# Altium project B100AA Development Kit.PrjPcb (part 4 of 5)

## Sheet ADS Sensor Sockets.SchDoc: Pressure Sensor Input Sockets
size A3; ApprovedBy: Mehmet Günce Akkoyun; CheckedBy: Mehmet Günce Akkoyun; Author: Mehmet Günce Akkoyun; CompanyName: Ovoo Electronics; DrawnBy: Mehmet Günce Akkoyun; Engineer: Mehmet Günce Akkoyun; Organization: Ovoo Electronics; Address1: Necip Fazýl Mah. Ortaýrmak Sok.; Address2: Birgül Apt. No: 19/6; Address3: Meram / Konya; Address4: Turkiye; DocumentNumber: AA001; Revision: B100AA Dev Kit
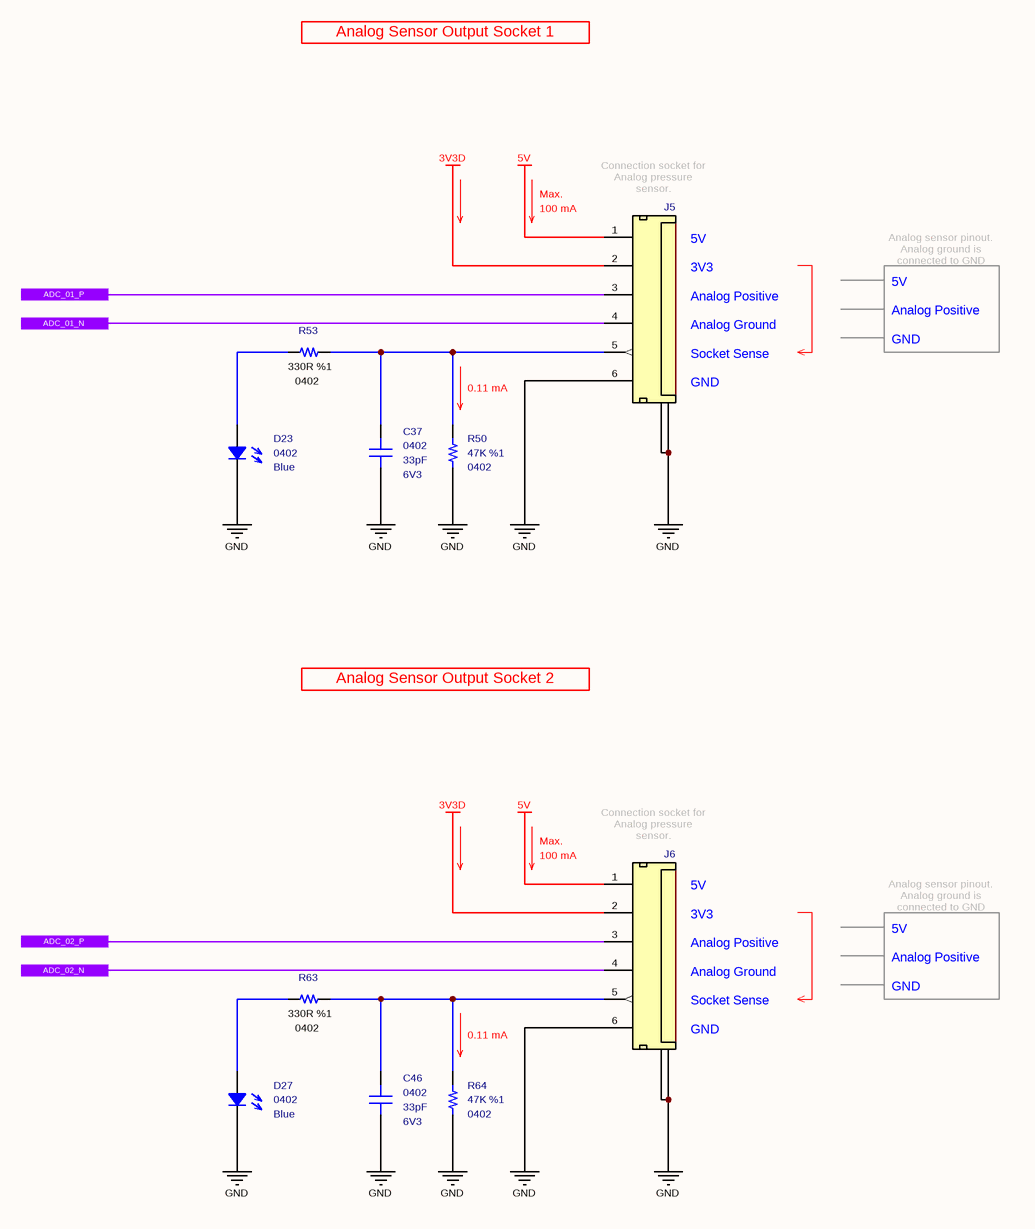
[diagram p25: ADS Sensor Sockets.SchDoc]

### Parts
C37  value 33pF  Case: 0402  Voltage: 6V3  [CAPACITOR_0402]  (hidden comment: Multilayer Ceramic Capacitor)
C46  value 33pF  Case: 0402  Voltage: 6V3  [CAPACITOR_0402]  (hidden comment: Multilayer Ceramic Capacitor)
D23  Case: 0402  Color: Blue  [LED_0402]  (hidden comment: SMD LED (Blue))
D27  Case: 0402  Color: Blue  [LED_0402]  (hidden comment: SMD LED (Blue))
J5  6P Tunic Connector  [Connector_Tunic 6P - H]  (value not drawn)
J6  6P Tunic Connector  [Connector_Tunic 6P - H]  (value not drawn)
R50  value 47K  Tolerance: %1  Case: 0402  [RESISTOR_0402]  (hidden comment: Thick Film Resistor)
R53  value 330R  Tolerance: %1  Case: 0402  [RESISTOR_0402]  (hidden comment: Thick Film Resistor)
R63  value 330R  Tolerance: %1  Case: 0402  [RESISTOR_0402]  (hidden comment: Thick Film Resistor)
R64  value 47K  Tolerance: %1  Case: 0402  [RESISTOR_0402]  (hidden comment: Thick Film Resistor)

### Ports
ADC_01_N, ADC_01_P, ADC_02_N, ADC_02_P

### Nets
3V3D: J5.2(M_DRV) J6.2(M_DRV)
5V: J5.1(VBAT) J6.1(VBAT)
GND: C37.2 C46.2 D23.1 D27.1 J5.6(M_DRV) J5.7(GND) J5.8(GND) J6.6(M_DRV) J6.7(GND) J6.8(GND) R50.1 R64.1
NetC37_1: C37.1 J5.5(M_DRV) R50.2 R53.2
NetC46_1: C46.1 J6.5(M_DRV) R63.2 R64.2
NetD23_2: D23.2 R53.1
NetD27_2: D27.2 R63.1
NetJ5_3: J5.3(M_DRV) ; port ADC_01_P
NetJ5_4: J5.4(M_DRV) ; port ADC_01_N
NetJ6_3: J6.3(M_DRV) ; port ADC_02_P
NetJ6_4: J6.4(M_DRV) ; port ADC_02_N

### Notes on the sheet
- Analog Sensor Output Socket 1
- Max.
- (near J5) Connection socket for Analog pressure sensor.
- 100 mA
- Analog sensor pinout. Analog ground is connected to GND
- 5V
  Analog Positive
  GND
- (near R50) 0.11 mA
- (near J5) 5V
  3V3
  Analog Positive
  Analog Ground
  Socket Sense
  GND
- Analog Sensor Output Socket 2
- (near J6) Connection socket for Analog pressure sensor.
- (near R64) 0.11 mA
- (near J6) 5V
  3V3
  Analog Positive
  Analog Ground
  Socket Sense
  GND
- Title
- Size:
- Date:
- A3
- Number:
- Time:
- Revision:
- Sheet
- of
- File:

### Library data of the parts
C37 C46 = Capacitor - 33pF [0402-6V3]: Capacitor - 33pF [0402] (Ceramic); Manufacturer_Name: Kemet; Manufacturer_Part_Number: C0402C330J9RACAUTO; Dielectric: X7R; Tolerance: 10%; Height: 0.5mm; Mouser_Part_Number: 80-C0402C330J9RAUTO; Maximum Operating Temperature: +125; Minimum Operating Temperature: -55; ROHS: Yes; ComponentLink1Description: DataSheet; ComponentLink1URL: https://api.kemet.com/component-edge/download/datasheet/C0402C330J9RACAUTO.pdf; ComponentLink2Description: Mouser; ComponentLink2URL: https://www.mouser.com/Search/Refine.aspx?Keyword=80-C0402C330J9RAUTO; Supplier 1: Mouser; Supplier Part Number 1: 80-C0402C330J9RAUTO
D23 D27 = Diode - LED (0402-Blue): as D53-D55 on sheet GSM Control Signals; Mouser_Part_Number: 755-SMLP13BC8TT86; ROHS: Yes; ComponentLink1Description: DataSheet; ComponentLink1URL: https://d1d2qsbl8m0m72.cloudfront.net/en/products/databook/datasheet/opto/led/chip_mono/sml-p1-e.pdf; ComponentLink2Description: Mouser; ComponentLink2URL: https://www.mouser.com.tr/ProductDetail/ROHM-Semiconductor/SMLP13BC8TT86?qs=%2Fha2pyFaduidYDgXFKL%252BNZwCVZNUI4FlyPWWbVDx1b6ABmzS%252BS2f0w%3D%3D; Supplier 1: Mouser; Supplier 2: Digi-Key; Supplier Part Number 1: 755-SMLP13BC8TT86; Supplier Part Number 2: 846-1112-1-ND
J5 J6 = Connector - Mini Tunic 6P (1.25): Mini Tunic Connector with 6P; Manufacturer_Name: Molex; Manufacturer_Part_Number: 53261-0671; ROHS: Yes; Supplier 1: Avnet; Supplier 2: Mouser; Supplier 3: Arrow; Supplier 4: Farnell; Supplier 5: Newark; Supplier 6: Digi-Key; Supplier Part Number 1: 0532610671; Supplier Part Number 2: 538-53261-0671; Supplier Part Number 3: 53261-0671; Supplier Part Number 4: 1125375; Supplier Part Number 5: 93K4246; Supplier Part Number 6: WM7624CT-ND; System: Connector
R50 R64 = Resistor - 47K: Thick Film Resistors - SMD 1/16 W 47 Kohms 1%; Manufacturer_Name: Vishay; Manufacturer_Part_Number: CRCW040247K0FKED; Height: 0.4mm; Mouser_Part_Number: 71-CRCW0402-47K-E3; ComponentLink1Description: DataSheet; ComponentLink1URL: https://www.mouser.com.tr/datasheet/2/427/dcrcwe3-1762152.pdf; ComponentLink2Description: Mouser; ComponentLink2URL: https://www.mouser.com.tr/ProductDetail/Vishay-Dale/CRCW040247K0FKED?qs=sGAEpiMZZMu61qfTUdNhG2DpbjADlD3GL%252B3h1elTxqU%3D; Supplier 1: Mouser; Supplier 2: Digi-Key; Supplier Part Number 1: 71-CRCW040247K0FKEDH; Supplier Part Number 2: 541-47.0KYCT-ND
R53 R63 = Resistor - 330R: as R120-R122 on sheet GSM Control Signals; Height: 0.4mm; ComponentLink1Description: DataSheet; ComponentLink1URL: https://www.mouser.com.tr/datasheet/2/427/dcrcwe3-1762152.pdf; ComponentLink2Description: Mouser; ComponentLink2URL: https://www.mouser.com.tr/ProductDetail/Vishay-Dale/CRCW0402330RFKED?qs=sGAEpiMZZMu61qfTUdNhG2DpbjADlD3GGS6SwBlLi5Q%3D; Supplier 1: Mouser; Supplier 2: Digi-Key; Supplier Part Number 2: 541-330LCT-ND; Supplier Part Number 1: 71-CRCW0402-330-E3; Mouser Part Number: 71-CRCW0402-330-E3

## Sheet Digital ICSP Test Points.SchDoc: Digital ICSP Outputs
size A4; ApprovedBy: Mehmet Günce Akkoyun; CheckedBy: Mehmet Günce Akkoyun; Author: Mehmet Günce Akkoyun; CompanyName: Ovoo Electronics; DrawnBy: Mehmet Günce Akkoyun; Engineer: Mehmet Günce Akkoyun; Organization: Ovoo Electronics; Address1: Necip Fazýl Mah. Ortaýrmak Sok.; Address2: Birgül Apt. No: 19/6; Address3: Meram / Konya; Address4: Turkiye; DocumentNumber: AA001; Revision: B100AA Dev Kit
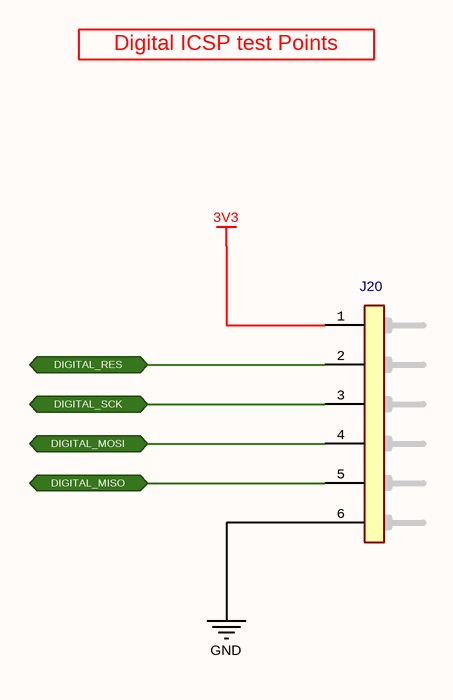
[diagram p26: Digital ICSP Test Points.SchDoc]

### Parts
J20  2.54 mm Pitch 6P Male Connector  [6P Header]  (value not drawn)

### Ports
DIGITAL_MISO (bidir), DIGITAL_MOSI (bidir), DIGITAL_RES (bidir), DIGITAL_SCK (bidir)

### Nets
3V3: J20.1(Pin-1)
GND: J20.6(Pin-6)
NetJ12_43: J20.2(Pin-2) ; port DIGITAL_RES
NetJ12_44: J20.3(Pin-3) ; port DIGITAL_SCK
NetJ12_45: J20.4(Pin-4) ; port DIGITAL_MOSI
NetJ12_46: J20.5(Pin-5) ; port DIGITAL_MISO

### Notes on the sheet
- Digital ICSP test Points
- Title
- Size:
- Date:
- A4
- Number:
- Time:
- Revision:
- Sheet
- of
- File:

### Library data of the parts
J20 = Connector - Male Header 6P (2.54): Headers & Wire Housings BREAKAWAY HDR VERT 6; Manufacturer Name: Molex; Position: 6; Row: 1; Pitch: 2.54 mm; Manufacturer Part Number: 22-28-4063; Mouser Part Number: 538-22-28-4063; ROHS: Yes; ComponentLink1Description: DataSheet; ComponentLink1URL: https://www.mouser.com.tr/datasheet/2/276/0022284063_PCB_HEADERS-228265.pdf; ComponentLink2Description: Mouser; ComponentLink2URL: https://www.mouser.com.tr/ProductDetail/Molex/22-28-4063?qs=sGAEpiMZZMs%252BGHln7q6pm%252BS0pk2Wo0XxVjxVgqsrZJ8%3D; Supplier 1: Mouser; Supplier 2: Digi-Key; Supplier Part Number 2: WM50016-06-ND; Supplier Part Number 1: 538-22-28-4063

## Sheet Master MCU ICSP Communication.SchDoc: Master MCU ICSP Communication Socket
size A4; ApprovedBy: Mehmet Günce Akkoyun; CheckedBy: Mehmet Günce Akkoyun; Author: Mehmet Günce Akkoyun; CompanyName: Ovoo Electronics; DrawnBy: Mehmet Günce Akkoyun; Engineer: Mehmet Günce Akkoyun; Organization: Ovoo Electronics; Address1: Necip Fazýl Mah. Ortaýrmak Sok.; Address2: Birgül Apt. No: 19/6; Address3: Meram / Konya; Address4: Turkiye; DocumentNumber: AA001; Revision: B100AA Dev Kit
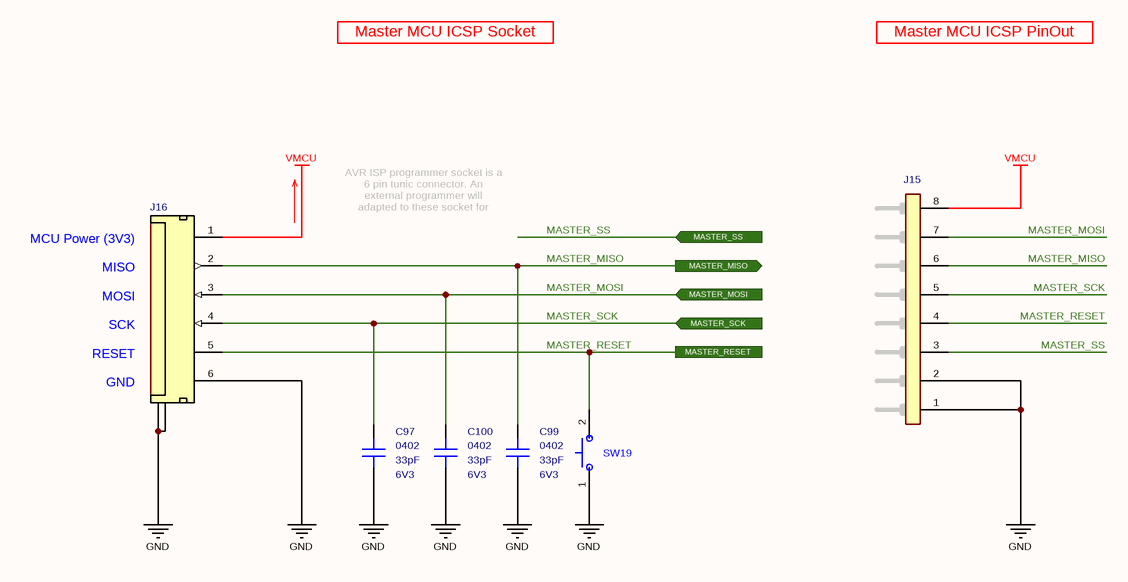
[diagram p27: Master MCU ICSP Communication.SchDoc]

### Parts
C97  value 33pF  Case: 0402  Voltage: 6V3  [CAPACITOR_0402]  (hidden comment: Multilayer Ceramic Capacitor)
C99  value 33pF  Case: 0402  Voltage: 6V3  [CAPACITOR_0402]  (hidden comment: Multilayer Ceramic Capacitor)
C100  value 33pF  Case: 0402  Voltage: 6V3  [CAPACITOR_0402]  (hidden comment: Multilayer Ceramic Capacitor)
J15  2.54 mm Pitch 8P Male Connector  [8P Header]  (value not drawn)
J16  6P Tunic Connector  [Connector_Tunic 6P - H]  (value not drawn)
SW19  Tactile Switches  [PTS526_Switch]  (value not drawn)

### Ports
MASTER_MISO (out), MASTER_MOSI (in), MASTER_RESET, MASTER_SCK (in), MASTER_SS (in)

### Nets
GND: C97.2 C99.2 C100.2 J15.1(Pin-1) J15.2(Pin-2) J16.6(M_DRV) J16.7(GND) J16.8(GND) SW19.1(NC)
VMCU: J15.8(Pin-8) J16.1(VBAT)
MASTER_MISO: C99.1 J15.6(Pin-6) J16.2(M_DRV) ; port MASTER_MISO
MASTER_MOSI: C100.1 J15.7(Pin-7) J16.3(M_DRV) ; port MASTER_MOSI
MASTER_RESET: J15.4(Pin-4) J16.5(M_DRV) SW19.2(COM) ; port MASTER_RESET
MASTER_SCK: C97.1 J15.5(Pin-5) J16.4(M_DRV) ; port MASTER_SCK
MASTER_SS: J15.3(Pin-3) ; port MASTER_SS

### Notes on the sheet
- Master MCU ICSP Socket
- Master MCU ICSP PinOut
- AVR ISP programmer socket is a 6 pin tunic connector. An external programmer will adapted to these socket for programming MCU.
- (near J16) MCU Power (3V3)
  MISO
  MOSI
  SCK
  RESET
  GND
- Title
- Size:
- Date:
- A4
- Number:
- Time:
- Revision:
- Sheet
- of
- File:

### Library data of the parts
C97 C99 C100 = Capacitor - 33pF [0402-6V3]: as C37 on sheet ADS Sensor Sockets; Height: 0.5mm; Mouser_Part_Number: 80-C0402C330J9RAUTO; Maximum Operating Temperature: +125; Minimum Operating Temperature: -55; ROHS: Yes; ComponentLink1Description: DataSheet; ComponentLink1URL: https://api.kemet.com/component-edge/download/datasheet/C0402C330J9RACAUTO.pdf; ComponentLink2Description: Mouser; ComponentLink2URL: https://www.mouser.com/Search/Refine.aspx?Keyword=80-C0402C330J9RAUTO; Supplier 1: Mouser; Supplier Part Number 1: 80-C0402C330J9RAUTO
J15 = Connector - Male Header 8P (2.54): Headers & Wire Housings BREAKAWAY HDR VERT 8; Manufacturer Name: Molex; Position: 8; Row: 1; Pitch: 2.54 mm; Manufacturer Part Number: 22-28-4083; Mouser Part Number: 538-22-28-4083; ROHS: Yes; ComponentLink1Description: DataSheet; ComponentLink1URL: https://www.mouser.com.tr/datasheet/2/276/0022284063_PCB_HEADERS-228265.pdf; ComponentLink2Description: Mouser; ComponentLink2URL: https://www.mouser.com.tr/ProductDetail/Molex/22-28-4083/?qs=%2Fha2pyFaduguMWEp6M%252Bj0x6fHxUvnRGD%252BIxBoa6MO5w%3D
J16 = Connector - Mini Tunic 6P (1.25): as J5 on sheet ADS Sensor Sockets; ROHS: Yes; Supplier 1: Avnet; Supplier 2: Mouser; Supplier 3: Arrow; Supplier 4: Farnell; Supplier 5: Newark; Supplier 6: Digi-Key; Supplier Part Number 1: 0532610671; Supplier Part Number 2: 538-53261-0671; Supplier Part Number 3: 53261-0671; Supplier Part Number 4: 1125375; Supplier Part Number 5: 93K4246; Supplier Part Number 6: WM7624CT-ND; System: Connector
SW19 = Switch - Tactile: Tactile Switches 50mA 12VDC, 5.2x5.2mm, 0.8mm H, 260gf, G leads.; Manufacturer Name: C&K Switches; Manufacturer Part Number: PTS526 SK08 SMTR2 LFS; Height: 0.8mm; Mouser Part Number: 611-PTS526SK08SMTR2L; ComponentLink1Description: DataSheet; ComponentLink1URL: https://eu.mouser.com/datasheet/2/60/pts526-1651200.pdf; ComponentLink2Description: Mouser; ComponentLink2URL: https://eu.mouser.com/ProductDetail/CK/PTS526-SK08-SMTR2-LFS?qs=sGAEpiMZZMsgGjVA3toVBL%2FRce%252ByN3s1hQPqiLlQ%252BeM%3D; Supplier 1: Future Electronics; Supplier 2: Mouser; Supplier 3: Arrow; Supplier 4: Digi-Key; Supplier Part Number 1: PTS526SK08SMTR2LFS-REEL; Supplier Part Number 2: 611-PTS526SK08SMTR2L; Supplier Part Number 3: PTS526 SK08 SMTR2 LFS; Supplier Part Number 4: CKN12219-1-ND

## Sheet UART Communication.SchDoc: UART Communication
size A2; ApprovedBy: Mehmet Günce Akkoyun; CheckedBy: Mehmet Günce Akkoyun; Author: Mehmet Günce Akkoyun; CompanyName: Ovoo Electronics; DrawnBy: Mehmet Günce Akkoyun; Engineer: Mehmet Günce Akkoyun; Organization: Ovoo Electronics; Address1: Necip Fazýl Mah. Ortaýrmak Sok.; Address2: Birgül Apt. No: 19/6; Address3: Meram / Konya; Address4: Turkiye; DocumentNumber: AA001; Revision: B100AA Dev Kit
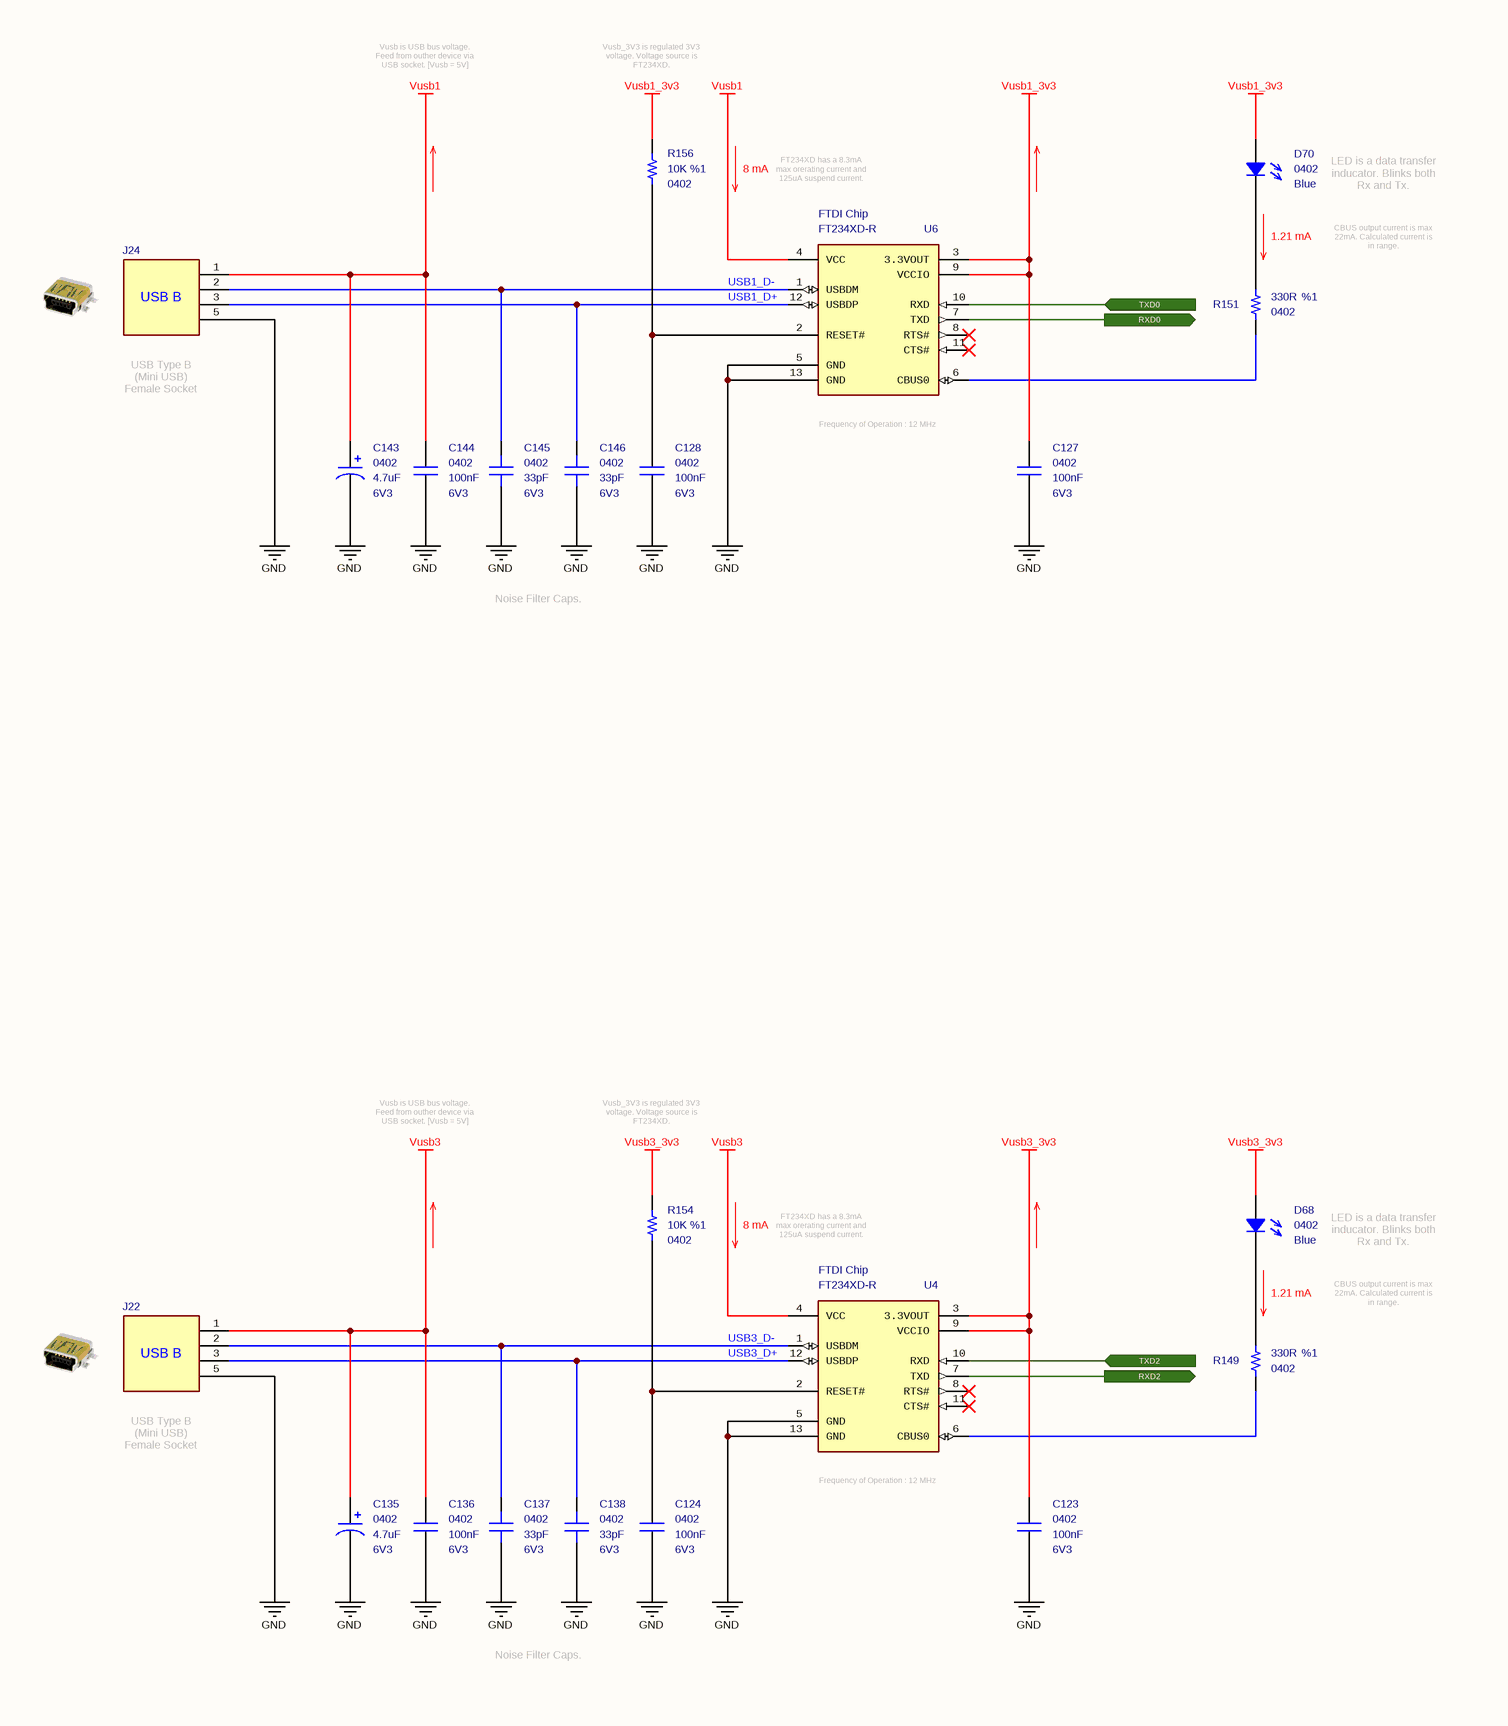
[diagram p28: UART Communication.SchDoc, left]
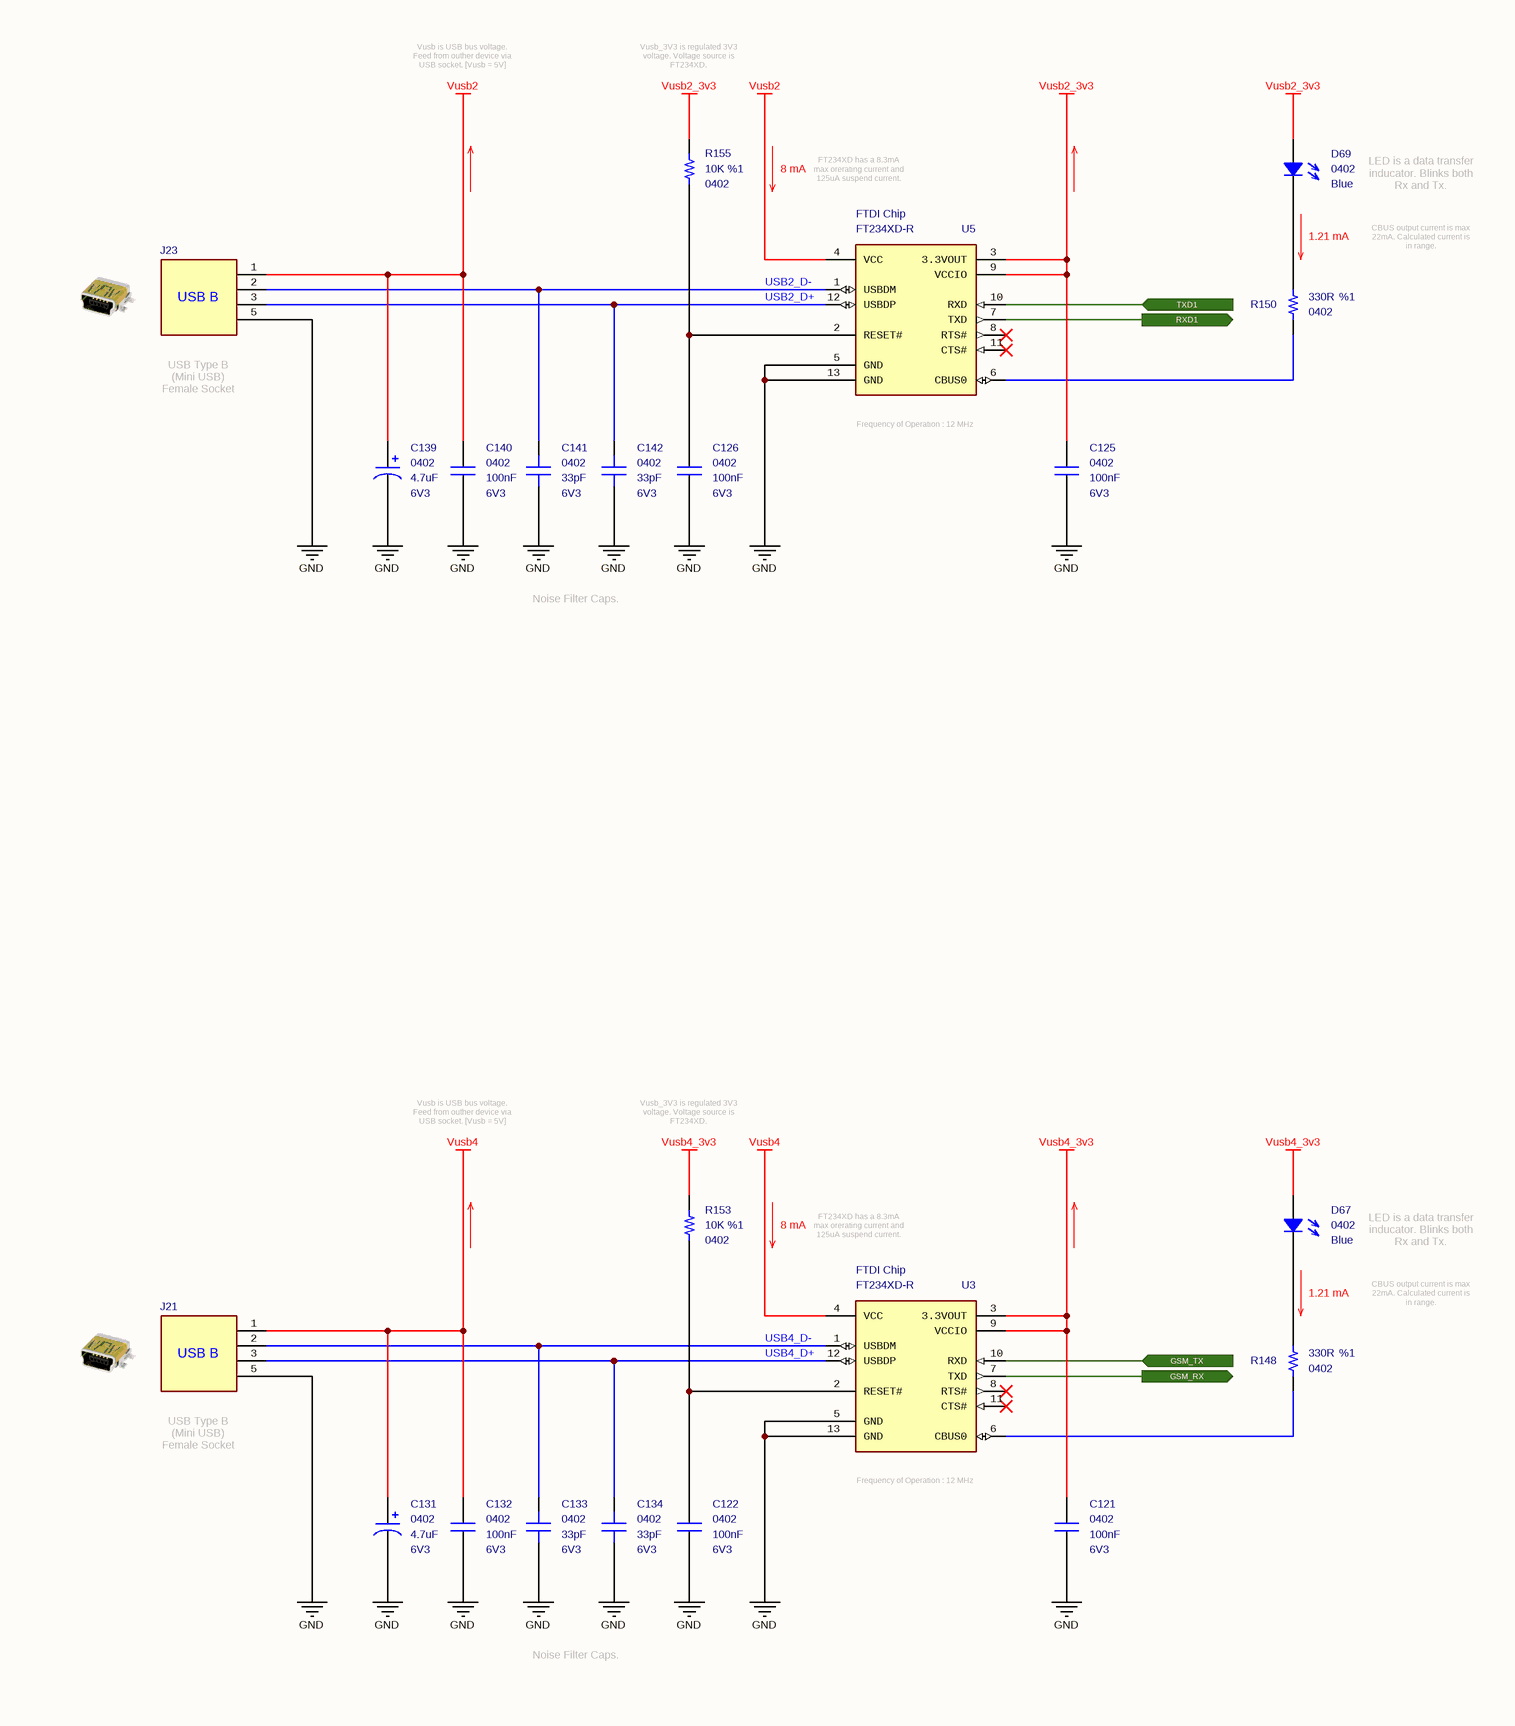
[diagram p29: UART Communication.SchDoc, right]

### Parts
C121  value 100nF  Case: 0402  Voltage: 6V3  [CAPACITOR_0402]  (hidden comment: Multilayer Ceramic Capacitor)
C122  value 100nF  Case: 0402  Voltage: 6V3  [CAPACITOR_0402]  (hidden comment: Multilayer Ceramic Capacitor)
C123  value 100nF  Case: 0402  Voltage: 6V3  [CAPACITOR_0402]  (hidden comment: Multilayer Ceramic Capacitor)
C124  value 100nF  Case: 0402  Voltage: 6V3  [CAPACITOR_0402]  (hidden comment: Multilayer Ceramic Capacitor)
C125  value 100nF  Case: 0402  Voltage: 6V3  [CAPACITOR_0402]  (hidden comment: Multilayer Ceramic Capacitor)
C126  value 100nF  Case: 0402  Voltage: 6V3  [CAPACITOR_0402]  (hidden comment: Multilayer Ceramic Capacitor)
C127  value 100nF  Case: 0402  Voltage: 6V3  [CAPACITOR_0402]  (hidden comment: Multilayer Ceramic Capacitor)
C128  value 100nF  Case: 0402  Voltage: 6V3  [CAPACITOR_0402]  (hidden comment: Multilayer Ceramic Capacitor)
C131  value 4.7uF  Case: 0402  Voltage: 6V3  [CAPACITOR_0402]  (hidden comment: Multilayer Ceramic Capacitors)
C132  value 100nF  Case: 0402  Voltage: 6V3  [CAPACITOR_0402]  (hidden comment: Multilayer Ceramic Capacitor)
C133  value 33pF  Case: 0402  Voltage: 6V3  [CAPACITOR_0402]  (hidden comment: Multilayer Ceramic Capacitor)
C134  value 33pF  Case: 0402  Voltage: 6V3  [CAPACITOR_0402]  (hidden comment: Multilayer Ceramic Capacitor)
C135  value 4.7uF  Case: 0402  Voltage: 6V3  [CAPACITOR_0402]  (hidden comment: Multilayer Ceramic Capacitors)
C136  value 100nF  Case: 0402  Voltage: 6V3  [CAPACITOR_0402]  (hidden comment: Multilayer Ceramic Capacitor)
C137  value 33pF  Case: 0402  Voltage: 6V3  [CAPACITOR_0402]  (hidden comment: Multilayer Ceramic Capacitor)
C138  value 33pF  Case: 0402  Voltage: 6V3  [CAPACITOR_0402]  (hidden comment: Multilayer Ceramic Capacitor)
C139  value 4.7uF  Case: 0402  Voltage: 6V3  [CAPACITOR_0402]  (hidden comment: Multilayer Ceramic Capacitors)
C140  value 100nF  Case: 0402  Voltage: 6V3  [CAPACITOR_0402]  (hidden comment: Multilayer Ceramic Capacitor)
C141  value 33pF  Case: 0402  Voltage: 6V3  [CAPACITOR_0402]  (hidden comment: Multilayer Ceramic Capacitor)
C142  value 33pF  Case: 0402  Voltage: 6V3  [CAPACITOR_0402]  (hidden comment: Multilayer Ceramic Capacitor)
C143  value 4.7uF  Case: 0402  Voltage: 6V3  [CAPACITOR_0402]  (hidden comment: Multilayer Ceramic Capacitors)
C144  value 100nF  Case: 0402  Voltage: 6V3  [CAPACITOR_0402]  (hidden comment: Multilayer Ceramic Capacitor)
C145  value 33pF  Case: 0402  Voltage: 6V3  [CAPACITOR_0402]  (hidden comment: Multilayer Ceramic Capacitor)
C146  value 33pF  Case: 0402  Voltage: 6V3  [CAPACITOR_0402]  (hidden comment: Multilayer Ceramic Capacitor)
D67  Case: 0402  Color: Blue  [LED_0402]  (hidden comment: SMD LED (Blue))
D68  Case: 0402  Color: Blue  [LED_0402]  (hidden comment: SMD LED (Blue))
D69  Case: 0402  Color: Blue  [LED_0402]  (hidden comment: SMD LED (Blue))
D70  Case: 0402  Color: Blue  [LED_0402]  (hidden comment: SMD LED (Blue))
J21  Mini USB Type B Connector  [USB Micro B Female - Vertical]  (value not drawn)
J22  Mini USB Type B Connector  [USB Micro B Female - Vertical]  (value not drawn)
J23  Mini USB Type B Connector  [USB Micro B Female - Vertical]  (value not drawn)
J24  Mini USB Type B Connector  [USB Micro B Female - Vertical]  (value not drawn)
R148  value 330R  Tolerance: %1  Case: 0402  [RESISTOR_0402]  (hidden comment: Thick Film Resistor)
R149  value 330R  Tolerance: %1  Case: 0402  [RESISTOR_0402]  (hidden comment: Thick Film Resistor)
R150  value 330R  Tolerance: %1  Case: 0402  [RESISTOR_0402]  (hidden comment: Thick Film Resistor)
R151  value 330R  Tolerance: %1  Case: 0402  [RESISTOR_0402]  (hidden comment: Thick Film Resistor)
R153  value 10K  Tolerance: %1  Case: 0402  [RESISTOR_0402]  (hidden comment: Thick Film Resistor)
R154  value 10K  Tolerance: %1  Case: 0402  [RESISTOR_0402]  (hidden comment: Thick Film Resistor)
R155  value 10K  Tolerance: %1  Case: 0402  [RESISTOR_0402]  (hidden comment: Thick Film Resistor)
R156  value 10K  Tolerance: %1  Case: 0402  [RESISTOR_0402]  (hidden comment: Thick Film Resistor)
U3  Manufacturer_Part_Number: FT234XD-R  Manufacturer_Name: FTDI Chip  [DFN-12]  (hidden comment: USB/UART IC)
U4  Manufacturer_Part_Number: FT234XD-R  Manufacturer_Name: FTDI Chip  [DFN-12]  (hidden comment: USB/UART IC)
U5  Manufacturer_Part_Number: FT234XD-R  Manufacturer_Name: FTDI Chip  [DFN-12]  (hidden comment: USB/UART IC)
U6  Manufacturer_Part_Number: FT234XD-R  Manufacturer_Name: FTDI Chip  [DFN-12]  (hidden comment: USB/UART IC)

### Ports
GSM_RX (out), GSM_TX (in), RXD0 (out), RXD1 (out), RXD2 (out), TXD0 (in), TXD1 (in), TXD2 (in)

### Nets
GND: C121.2 C122.2 C123.2 C124.2 C125.2 C126.2 C127.2 C128.2 C131.2 C132.1 C133.2 C134.2 C135.2 C136.1 C137.2 C138.2 C139.2 C140.1 C141.2 C142.2 C143.2 C144.1 C145.2 C146.2 J21.5(GND) J22.5(GND) J23.5(GND) J24.5(GND) U3.5(GND) U3.13(GND) U4.5(GND) U4.13(GND) U5.5(GND) U5.13(GND) U6.5(GND) U6.13(GND)
Vusb1: C143.1 C144.2 J24.1(Vbus) U6.4(VCC)
Vusb1_3v3: C127.1 D70.2 R156.2 U6.3(3.3VOUT) U6.9(VCCIO)
Vusb2: C139.1 C140.2 J23.1(Vbus) U5.4(VCC)
Vusb2_3v3: C125.1 D69.2 R155.2 U5.3(3.3VOUT) U5.9(VCCIO)
Vusb3: C135.1 C136.2 J22.1(Vbus) U4.4(VCC)
Vusb3_3v3: C123.1 D68.2 R154.2 U4.3(3.3VOUT) U4.9(VCCIO)
Vusb4: C131.1 C132.2 J21.1(Vbus) U3.4(VCC)
Vusb4_3v3: C121.1 D67.2 R153.2 U3.3(3.3VOUT) U3.9(VCCIO)
USB1_D+: C146.1 J24.3(D+) U6.12(USBDP)
USB1_D-: C145.1 J24.2(D-) U6.1(USBDM)
USB2_D+: C142.1 J23.3(D+) U5.12(USBDP)
USB2_D-: C141.1 J23.2(D-) U5.1(USBDM)
USB3_D+: C138.1 J22.3(D+) U4.12(USBDP)
USB3_D-: C137.1 J22.2(D-) U4.1(USBDM)
USB4_D+: C134.1 J21.3(D+) U3.12(USBDP)
USB4_D-: C133.1 J21.2(D-) U3.1(USBDM)
NetC122_1: C122.1 R153.1 U3.2(RESET#)
NetC124_1: C124.1 R154.1 U4.2(RESET#)
NetC126_1: C126.1 R155.1 U5.2(RESET#)
NetC128_1: C128.1 R156.1 U6.2(RESET#)
NetD67_1: D67.1 R148.1
NetD68_1: D68.1 R149.1
NetD69_1: D69.1 R150.1
NetD70_1: D70.1 R151.1
NetJ7_35: U6.10(RXD) ; port TXD0
NetJ7_36: U6.7(TXD) ; port RXD0
NetJ7_37: U5.10(RXD) ; port TXD1
NetJ7_38: U5.7(TXD) ; port RXD1
NetJ7_39: U4.10(RXD) ; port TXD2
NetJ7_40: U4.7(TXD) ; port RXD2
NetJ12_56: U3.10(RXD) ; port GSM_TX
NetJ12_57: U3.7(TXD) ; port GSM_RX
NetR148_2: R148.2 U3.6(CBUS0)
NetR149_2: R149.2 U4.6(CBUS0)
NetR150_2: R150.2 U5.6(CBUS0)
NetR151_2: R151.2 U6.6(CBUS0)

Not connected (* = marked no-connect by the designer): U3 8(RTS#)* 11(CTS#)*; U4 8(RTS#)* 11(CTS#)*; U5 8(RTS#)* 11(CTS#)*; U6 8(RTS#)* 11(CTS#)*

### Notes on the sheet
- Vusb is USB bus voltage. Feed from outher device via USB socket. [Vusb = 5V]
- Vusb_3V3 is regulated 3V3 voltage. Voltage source is FT234XD.
- 8 mA
- FT234XD has a 8.3mA max orerating current and 125uA suspend current.
- LED is a data transfer inducator. Blinks both Rx and Tx.
- 1.21 mA
- CBUS output current is max 22mA. Calculated current is in range.
- (near J24) USB Type B
  (Mini USB)
  Female Socket
- (near U6) Frequency of Operation : 12 MHz
- (near J23) USB Type B
  (Mini USB)
  Female Socket
- (near U5) Frequency of Operation : 12 MHz
- Noise Filter Caps.
- (near J22) USB Type B
  (Mini USB)
  Female Socket
- (near U4) Frequency of Operation : 12 MHz
- (near J21) USB Type B
  (Mini USB)
  Female Socket
- (near U3) Frequency of Operation : 12 MHz
- Title
- Size:
- Date:
- File:
- A2
- Number:
- Time:
- Revision:
- Sheet
- of
- (in symbol Connector - Mini USB Female (Vertical)) USB B

### Library data of the parts
C121-C128 C132 C136 C140 C144 = Capacitor - 100nF [0402-6V3]: Capacitor - 100nF [0402-6V3] (Ceramic); Manufacturer_Name: AVX; Manufacturer_Part_Number: 04026D104KAT4A; Dielectric: X5R; Tolerance: %10; Height: 0.25mm; Mouser_Part_Number: 581-04026D104KAT4A; ComponentLink1Description: Mouser; ComponentLink1URL: https://www.mouser.com.tr/ProductDetail/AVX/04026D104KAT4A?qs=sGAEpiMZZMs0AnBnWHyRQPg4iYkCw7IMED%2F4kpqgf7w%3D; ComponentLink2Description: DataSheet; ComponentLink2URL: https://www.mouser.com.tr/datasheet/2/40/cx5r-776519.pdf; ROHS: Yes; Maximum Operating Temperature: +85; Minimum Operating Temperature: -55; Supplier 1: Avnet; Supplier Part Number 1: 04026D104KAT4A
C131 C135 C139 C143 = Capacitor - 4.7uF [0402-6V3): Capacitor - 4.7uF [0402] (Ceramic); Manufacturer_Name: Kemet; Manufacturer_Part_Number: C0402C475M9PACTU; Dielectric: X5R; Tolerance: %20; Height: 0.5mm; Mouser_Part_Number: 80-C0402C475M9P; ComponentLink1Description: Mouser; ComponentLink1URL: https://www.mouser.com.tr/ProductDetail/KEMET/C0402C475M9PACTU?qs=x4XeXhDQKnr0GX0Xu9DUoQ==; ComponentLink2Description: DataSheet; ComponentLink2URL: https://www.mouser.com.tr/datasheet/2/40/cx5r-776519.pdf; ROHS: Yes; Maximum Operating Temperature: +85; Minimum Operating Temperature: -55; Supplier 1: Mouser; Supplier 2: Arrow; Supplier 3: Farnell; Supplier 4: Digi-Key; Supplier Part Number 1: 80-C0402C475M9P; Supplier Part Number 2: C0402C475M9PACTU; Supplier Part Number 3: 2750760; Supplier Part Number 4: 399-13068-1-ND
C133 C134 C137 C138 C141 C142 C145 C146 = Capacitor - 33pF [0402-6V3]: as C37 on sheet ADS Sensor Sockets; Height: 0.5mm; Mouser_Part_Number: 80-C0402C330J9RAUTO; Maximum Operating Temperature: +125; Minimum Operating Temperature: -55; ROHS: Yes; ComponentLink1Description: DataSheet; ComponentLink1URL: https://api.kemet.com/component-edge/download/datasheet/C0402C330J9RACAUTO.pdf; ComponentLink2Description: Mouser; ComponentLink2URL: https://www.mouser.com/Search/Refine.aspx?Keyword=80-C0402C330J9RAUTO; Supplier 1: Mouser; Supplier Part Number 1: 80-C0402C330J9RAUTO
D67-D70 = Diode - LED (0402-Blue): as D53-D55 on sheet GSM Control Signals; Mouser_Part_Number: 755-SMLP13BC8TT86; ROHS: Yes; ComponentLink1Description: DataSheet; ComponentLink1URL: https://d1d2qsbl8m0m72.cloudfront.net/en/products/databook/datasheet/opto/led/chip_mono/sml-p1-e.pdf; ComponentLink2Description: Mouser; ComponentLink2URL: https://www.mouser.com.tr/ProductDetail/ROHM-Semiconductor/SMLP13BC8TT86?qs=%2Fha2pyFaduidYDgXFKL%252BNZwCVZNUI4FlyPWWbVDx1b6ABmzS%252BS2f0w%3D%3D; Supplier 1: Mouser; Supplier 2: Digi-Key; Supplier Part Number 1: 755-SMLP13BC8TT86; Supplier Part Number 2: 846-1112-1-ND
J21-J24 = Connector - Mini USB Female (Vertical): USB Connectors MINI B RECEPT RA SMT W/ POST; Manufacturer_Part_Number: 105133-0011; Manufacturer_Name: Molex; Pitch: 0.8mm; Contact: 5; ROHS: Yes; ComponentLink1Description: DataSheet; ComponentLink1URL: https://eu.mouser.com/datasheet/2/276/1051330011_IO_CONNECTORS-704707.pdf; ComponentLink2Description: Mouser; ComponentLink2URL: https://eu.mouser.com/ProductDetail/Molex/105133-0011?qs=sGAEpiMZZMulM8LPOQ%252Byk9ef5KmzwulGtEmCDWJwe7A%3D; Case: SMD; Mouser_Part_Number: 538-105133-0011; Supplier 1: Mouser; Supplier 2: Arrow; Supplier 3: Farnell; Supplier 4: Digi-Key; Supplier Part Number 1: 538-105133-0011; Supplier Part Number 2: 105133-0011; Supplier Part Number 3: 2614949; Supplier Part Number 4: WM10134CT-ND; System: Connector
R148-R151 = Resistor - 330R: Thick Film Resistors - SMD 1/16 W 330 Ohm 1%; Manufacturer_Name: Vishay; Manufacturer_Part_Number: CRCW0402330RFKED; Height: 0.4mm; Mouser_Part_Number: 71-CRCW0402-330-E3; ComponentLink1Description: DataSheet; ComponentLink1URL: https://www.mouser.com.tr/datasheet/2/427/dcrcwe3-1762152.pdf; ComponentLink2Description: Mouser; ComponentLink2URL: https://www.mouser.com.tr/ProductDetail/Vishay-Dale/CRCW0402330RFKED?qs=sGAEpiMZZMu61qfTUdNhG2DpbjADlD3GGS6SwBlLi5Q%3D; Supplier 1: Mouser; Supplier 2: Digi-Key; Supplier Part Number 2: 541-330LCT-ND; Supplier Part Number 1: 71-CRCW0402-330-E3
R153-R156 = Resistor - 10K: Thick Film Resistors - SMD 1/16 W 10 Kohms 1%; Manufacturer_Name: Vishay; Manufacturer_Part_Number: CRCW040210K0FKED; Height: 0.4mm; Mouser_Part_Number: 71-CRCW0402-10K-E3; ComponentLink1Description: DataSheet; ComponentLink1URL: https://www.mouser.com.tr/datasheet/2/427/dcrcwe3-1762152.pdf; ComponentLink2Description: Mouser; ComponentLink2URL: https://www.mouser.com.tr/ProductDetail/Vishay-Dale/CRCW040210K0FKED?qs=sGAEpiMZZMu61qfTUdNhG2DpbjADlD3GcalbOv9utCY%3D; Supplier 1: Mouser; Supplier 2: Digi-Key; Supplier Part Number 1: 71-CRCW040210K0FKEDH; Supplier Part Number 2: 541-10.0KYCT-ND
U3-U6 = IC - FT234XD-R: Height: 0.75mm; Mouser Part Number: 895-FT234XD-R; ComponentLink1Description: DataSheet; ComponentLink1URL: https://componentsearchengine.com/Datasheets/2/FT234XD-R.pdf; ComponentLink2Description: Mouser; ComponentLink2URL: https://www.mouser.com/Search/Refine.aspx?Keyword=895-FT234XD-R; Supplier 1: Mouser; Supplier 2: Arrow; Supplier 3: Farnell; Supplier 4: Newark; Supplier 5: Digi-Key; Supplier Part Number 1: 895-FT234XD-R; Supplier Part Number 2: FT234XD-R; Supplier Part Number 3: 2419911; Supplier Part Number 4: 53X3171; Supplier Part Number 5: 768-1178-1-ND

## Sheet Signal Outputs.SchDoc: Signal Output
size A3; ApprovedBy: Mehmet Günce Akkoyun; CheckedBy: Mehmet Günce Akkoyun; Author: Mehmet Günce Akkoyun; CompanyName: Ovoo Electronics; DrawnBy: Mehmet Günce Akkoyun; Engineer: Mehmet Günce Akkoyun; Organization: Ovoo Electronics; Address1: Necip Fazýl Mah. Ortaýrmak Sok.; Address2: Birgül Apt. No: 19/6; Address3: Meram / Konya; Address4: Turkiye; DocumentNumber: AA001; Revision: B100AA Dev Kit
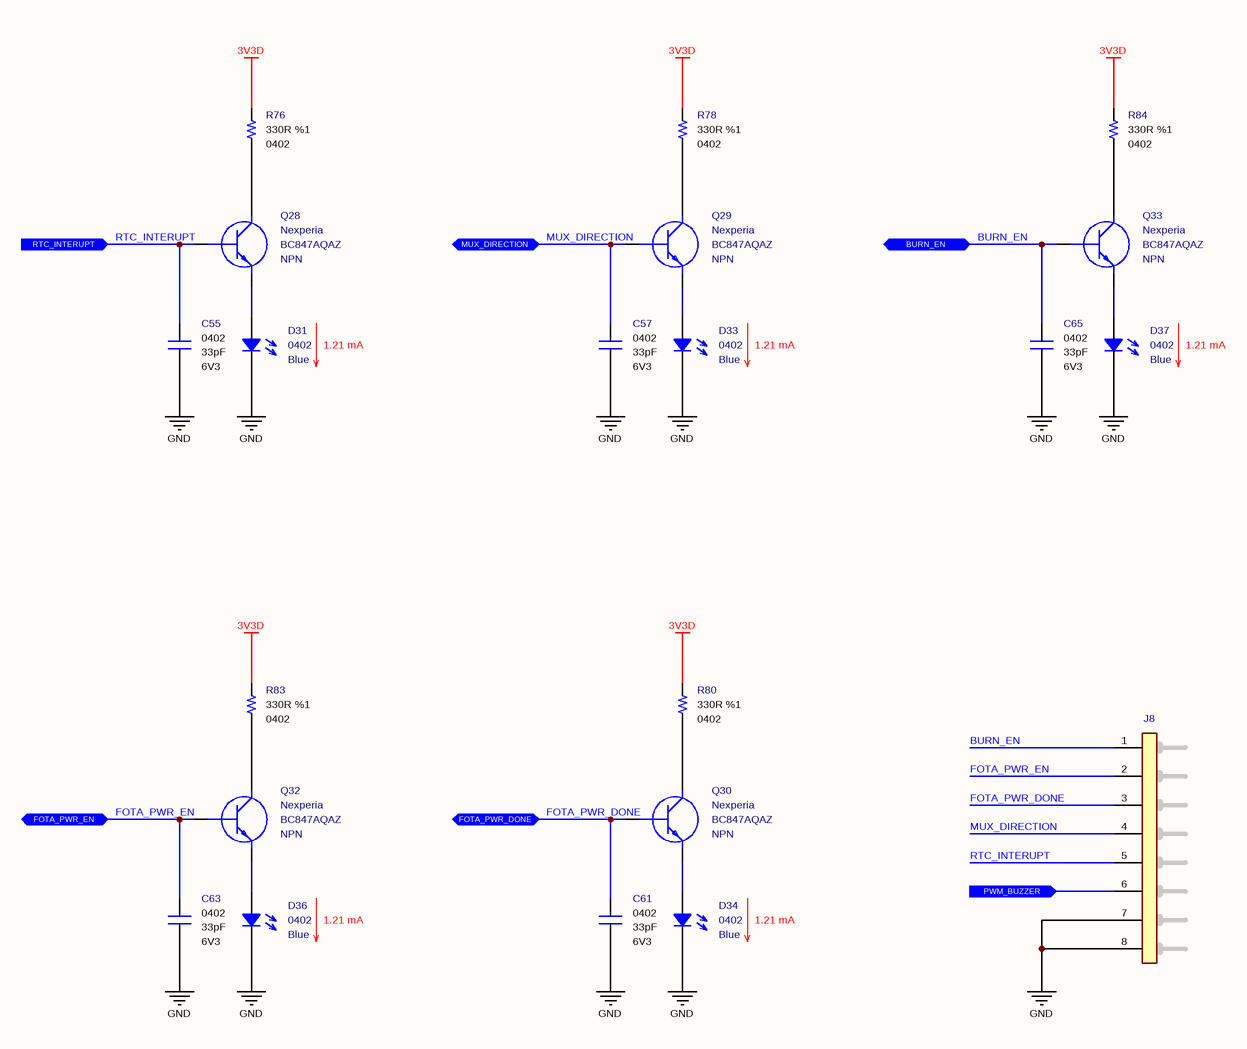
[diagram p30: Signal Outputs.SchDoc]

### Parts
C55  value 33pF  Case: 0402  Voltage: 6V3  [CAPACITOR_0402]  (hidden comment: Multilayer Ceramic Capacitor)
C57  value 33pF  Case: 0402  Voltage: 6V3  [CAPACITOR_0402]  (hidden comment: Multilayer Ceramic Capacitor)
C61  value 33pF  Case: 0402  Voltage: 6V3  [CAPACITOR_0402]  (hidden comment: Multilayer Ceramic Capacitor)
C63  value 33pF  Case: 0402  Voltage: 6V3  [CAPACITOR_0402]  (hidden comment: Multilayer Ceramic Capacitor)
C65  value 33pF  Case: 0402  Voltage: 6V3  [CAPACITOR_0402]  (hidden comment: Multilayer Ceramic Capacitor)
D31  Case: 0402  Color: Blue  [LED_0402]  (hidden comment: SMD LED (Blue))
D33  Case: 0402  Color: Blue  [LED_0402]  (hidden comment: SMD LED (Blue))
D34  Case: 0402  Color: Blue  [LED_0402]  (hidden comment: SMD LED (Blue))
D36  Case: 0402  Color: Blue  [LED_0402]  (hidden comment: SMD LED (Blue))
D37  Case: 0402  Color: Blue  [LED_0402]  (hidden comment: SMD LED (Blue))
J8  2.54 mm Pitch 8P Male Connector  [8P Header]  (value not drawn)
Q28  Manufacturer_Name: Nexperia  Manufacturer_Part_Number: BC847AQAZ  Polarity: NPN  [SOT1215]  (hidden comment: Bipolar NPN Transistors)
Q29  Manufacturer_Name: Nexperia  Manufacturer_Part_Number: BC847AQAZ  Polarity: NPN  [SOT1215]  (hidden comment: Bipolar NPN Transistors)
Q30  Manufacturer_Name: Nexperia  Manufacturer_Part_Number: BC847AQAZ  Polarity: NPN  [SOT1215]  (hidden comment: Bipolar NPN Transistors)
Q32  Manufacturer_Name: Nexperia  Manufacturer_Part_Number: BC847AQAZ  Polarity: NPN  [SOT1215]  (hidden comment: Bipolar NPN Transistors)
Q33  Manufacturer_Name: Nexperia  Manufacturer_Part_Number: BC847AQAZ  Polarity: NPN  [SOT1215]  (hidden comment: Bipolar NPN Transistors)
R76  value 330R  Tolerance: %1  Case: 0402  [RESISTOR_0402]  (hidden comment: Thick Film Resistor)
R78  value 330R  Tolerance: %1  Case: 0402  [RESISTOR_0402]  (hidden comment: Thick Film Resistor)
R80  value 330R  Tolerance: %1  Case: 0402  [RESISTOR_0402]  (hidden comment: Thick Film Resistor)
R83  value 330R  Tolerance: %1  Case: 0402  [RESISTOR_0402]  (hidden comment: Thick Film Resistor)
R84  value 330R  Tolerance: %1  Case: 0402  [RESISTOR_0402]  (hidden comment: Thick Film Resistor)

### Ports
BURN_EN (bidir), FOTA_PWR_DONE (bidir), FOTA_PWR_EN (bidir), MUX_DIRECTION (bidir), PWM_BUZZER (in), RTC_INTERUPT (in)

### Nets
3V3D: R76.2 R78.2 R80.2 R83.2 R84.2
GND: C55.2 C57.2 C61.2 C63.2 C65.2 D31.1 D33.1 D34.1 D36.1 D37.1 J8.7(Pin-7) J8.8(Pin-8)
BURN_EN: C65.1 J8.1(Pin-1) Q33.1(B) ; port BURN_EN
FOTA_PWR_DONE: C61.1 J8.3(Pin-3) Q30.1(B) ; port FOTA_PWR_DONE
FOTA_PWR_EN: C63.1 J8.2(Pin-2) Q32.1(B) ; port FOTA_PWR_EN
MUX_DIRECTION: C57.1 J8.4(Pin-4) Q29.1(B) ; port MUX_DIRECTION
RTC_INTERUPT: C55.1 J8.5(Pin-5) Q28.1(B) ; port RTC_INTERUPT
NetD31_2: D31.2 Q28.2(E)
NetD33_2: D33.2 Q29.2(E)
NetD34_2: D34.2 Q30.2(E)
NetD36_2: D36.2 Q32.2(E)
NetD37_2: D37.2 Q33.2(E)
NetJ7_48: J8.6(Pin-6) ; port PWM_BUZZER
NetQ28_3: Q28.3(C) R76.1
NetQ29_3: Q29.3(C) R78.1
NetQ30_3: Q30.3(C) R80.1
NetQ32_3: Q32.3(C) R83.1
NetQ33_3: Q33.3(C) R84.1

### Notes on the sheet
- 1.21 mA
- Title
- Size:
- Date:
- A3
- Number:
- Time:
- Revision:
- Sheet
- of
- File:

### Library data of the parts
C55 C57 C61 C63 C65 = Capacitor - 33pF [0402-6V3]: as C93-C95 on sheet GSM Control Signals; Height: 0.5mm; Maximum Operating Temperature: +125; Minimum Operating Temperature: -55; ROHS: Yes; ComponentLink1Description: DataSheet; ComponentLink1URL: https://api.kemet.com/component-edge/download/datasheet/C0402C330J9RACAUTO.pdf; ComponentLink2Description: Mouser; ComponentLink2URL: https://www.mouser.com/Search/Refine.aspx?Keyword=80-C0402C330J9RAUTO; Supplier 1: Mouser; Supplier Part Number 1: 80-C0402C330J9RAUTO; Mouser Part Number: 80-C0402C330J9RAUTO
D31 D33 D34 D36 D37 = Diode - LED (0402-Blue): as D53-D55 on sheet GSM Control Signals; Mouser_Part_Number: 755-SMLP13BC8TT86; ROHS: Yes; ComponentLink1Description: DataSheet; ComponentLink1URL: https://d1d2qsbl8m0m72.cloudfront.net/en/products/databook/datasheet/opto/led/chip_mono/sml-p1-e.pdf; ComponentLink2Description: Mouser; ComponentLink2URL: https://www.mouser.com.tr/ProductDetail/ROHM-Semiconductor/SMLP13BC8TT86?qs=%2Fha2pyFaduidYDgXFKL%252BNZwCVZNUI4FlyPWWbVDx1b6ABmzS%252BS2f0w%3D%3D; Supplier 1: Mouser; Supplier 2: Digi-Key; Supplier Part Number 1: 755-SMLP13BC8TT86; Supplier Part Number 2: 846-1112-1-ND
J8 = Connector - Male Header 8P (2.54): as J15 on sheet Master MCU ICSP Communication; Manufacturer Part Number: 22-28-4083; Mouser Part Number: 538-22-28-4083; ROHS: Yes; ComponentLink1Description: DataSheet; ComponentLink1URL: https://www.mouser.com.tr/datasheet/2/276/0022284063_PCB_HEADERS-228265.pdf; ComponentLink2Description: Mouser; ComponentLink2URL: https://www.mouser.com.tr/ProductDetail/Molex/22-28-4083/?qs=%2Fha2pyFaduguMWEp6M%252Bj0x6fHxUvnRGD%252BIxBoa6MO5w%3D
Q28-Q30 Q32 Q33 = Transistor - BC847: as Q50-Q52 on sheet GSM Control Signals; Mouser_Part_Number: 771-BC847AQAZ; ComponentLink1Description: DataSheet; ComponentLink1URL: https://www.mouser.com.tr/datasheet/2/916/BC847XQA_SER-1598405.pdf; ComponentLink2Description: Mouser; ComponentLink2URL: https://www.mouser.com.tr/ProductDetail/Nexperia/BC847AQAZ?qs=%2Fha2pyFaduhKMCPKNtQimeJpXTw9z4AqURd2YARs8DVICZNv3AT9Dw%3D%3D; Case: DFN-1010D-3; Supplier 1: Mouser; Supplier 2: Digi-Key; Supplier Part Number 1: 771-BC847AQAZ; Supplier Part Number 2: 1727-2545-1-ND
R76 R78 R80 R83 R84 = Resistor - 330R: as R120-R122 on sheet GSM Control Signals; Height: 0.4mm; ComponentLink1Description: DataSheet; ComponentLink1URL: https://www.mouser.com.tr/datasheet/2/427/dcrcwe3-1762152.pdf; ComponentLink2Description: Mouser; ComponentLink2URL: https://www.mouser.com.tr/ProductDetail/Vishay-Dale/CRCW0402330RFKED?qs=sGAEpiMZZMu61qfTUdNhG2DpbjADlD3GGS6SwBlLi5Q%3D; Supplier 1: Mouser; Supplier 2: Digi-Key; Supplier Part Number 2: 541-330LCT-ND; Supplier Part Number 1: 71-CRCW0402-330-E3; Mouser Part Number: 71-CRCW0402-330-E3

## Sheet Power Network.SchDoc: Power Port
size A4; ApprovedBy: Mehmet Günce Akkoyun; CheckedBy: Mehmet Günce Akkoyun; Author: Mehmet Günce Akkoyun; CompanyName: Ovoo Electronics; DrawnBy: Mehmet Günce Akkoyun; Engineer: Mehmet Günce Akkoyun; Organization: Ovoo Electronics; Address1: Necip Fazýl Mah. Ortaýrmak Sok.; Address2: Birgül Apt. No: 19/6; Address3: Meram / Konya; Address4: Turkiye; DocumentNumber: AA001; Revision: B100AA Dev Kit
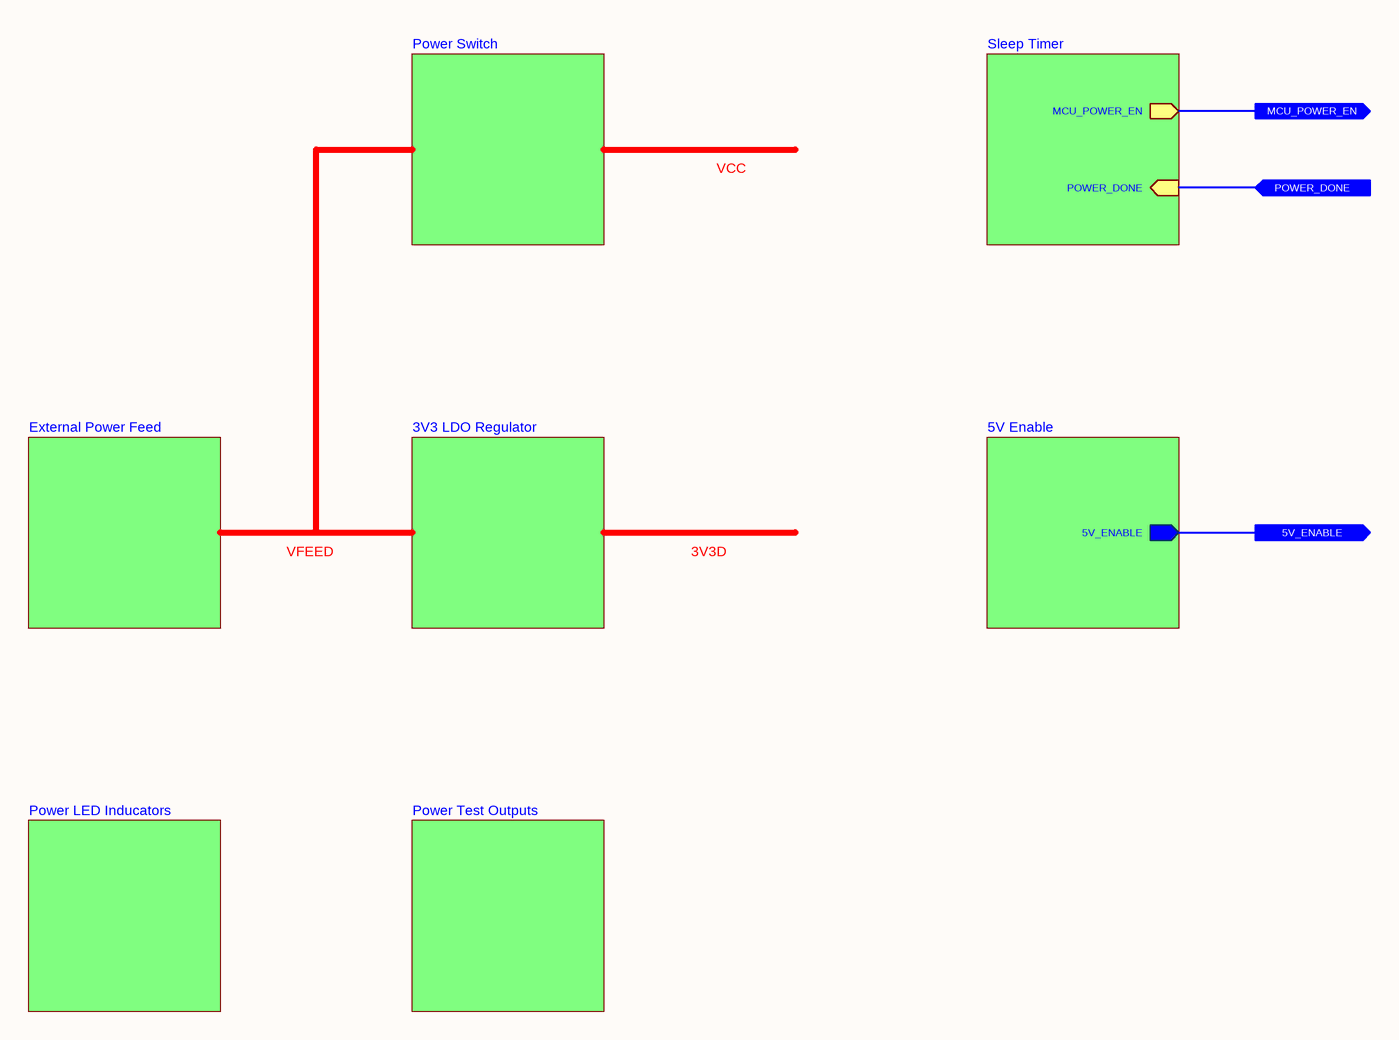
[diagram p31: Power Network.SchDoc]

### Sub-sheets
3V3 LDO Regulator = 3V3 LDO Regulator.SchDoc: no entries
5V Enable = 5V Enable.SchDoc: 5V_ENABLE (out)
External Power Feed = External Power Feed.SchDoc: no entries
Power LED Inducators = Power LED Inducators.SchDoc: no entries
Power Switch = Power Switch.SchDoc: no entries
Power Test Outputs = Power Test Pins.SchDoc: no entries
Sleep Timer = Sleep Timer.SchDoc: MCU_POWER_EN (out), POWER_DONE (in)

### Ports
5V_ENABLE (out), MCU_POWER_EN (out), POWER_DONE (in)

### Nets
MCU_POWER_EN: port MCU_POWER_EN, sheet Sleep Timer/MCU_POWER_EN
POWER_DONE: port POWER_DONE, sheet Sleep Timer/POWER_DONE
NetC24_2: port 5V_ENABLE, sheet 5V Enable/5V_ENABLE

### Notes on the sheet
- VCC
- VFEED
- 3V3D
- Title
- Size:
- Date:
- A4
- Number:
- Time:
- Revision:
- Sheet
- of
- File:

## Sheet Power LED Inducators.SchDoc: Power LED Inducators
size A3; ApprovedBy: Mehmet Günce Akkoyun; CheckedBy: Mehmet Günce Akkoyun; Author: Mehmet Günce Akkoyun; CompanyName: Ovoo Electronics; DrawnBy: Mehmet Günce Akkoyun; Engineer: Mehmet Günce Akkoyun; Organization: Ovoo Electronics; Address1: Necip Fazýl Mah. Ortaýrmak Sok.; Address2: Birgül Apt. No: 19/6; Address3: Meram / Konya; Address4: Turkiye; DocumentNumber: AA001; Revision: B100AA Dev Kit
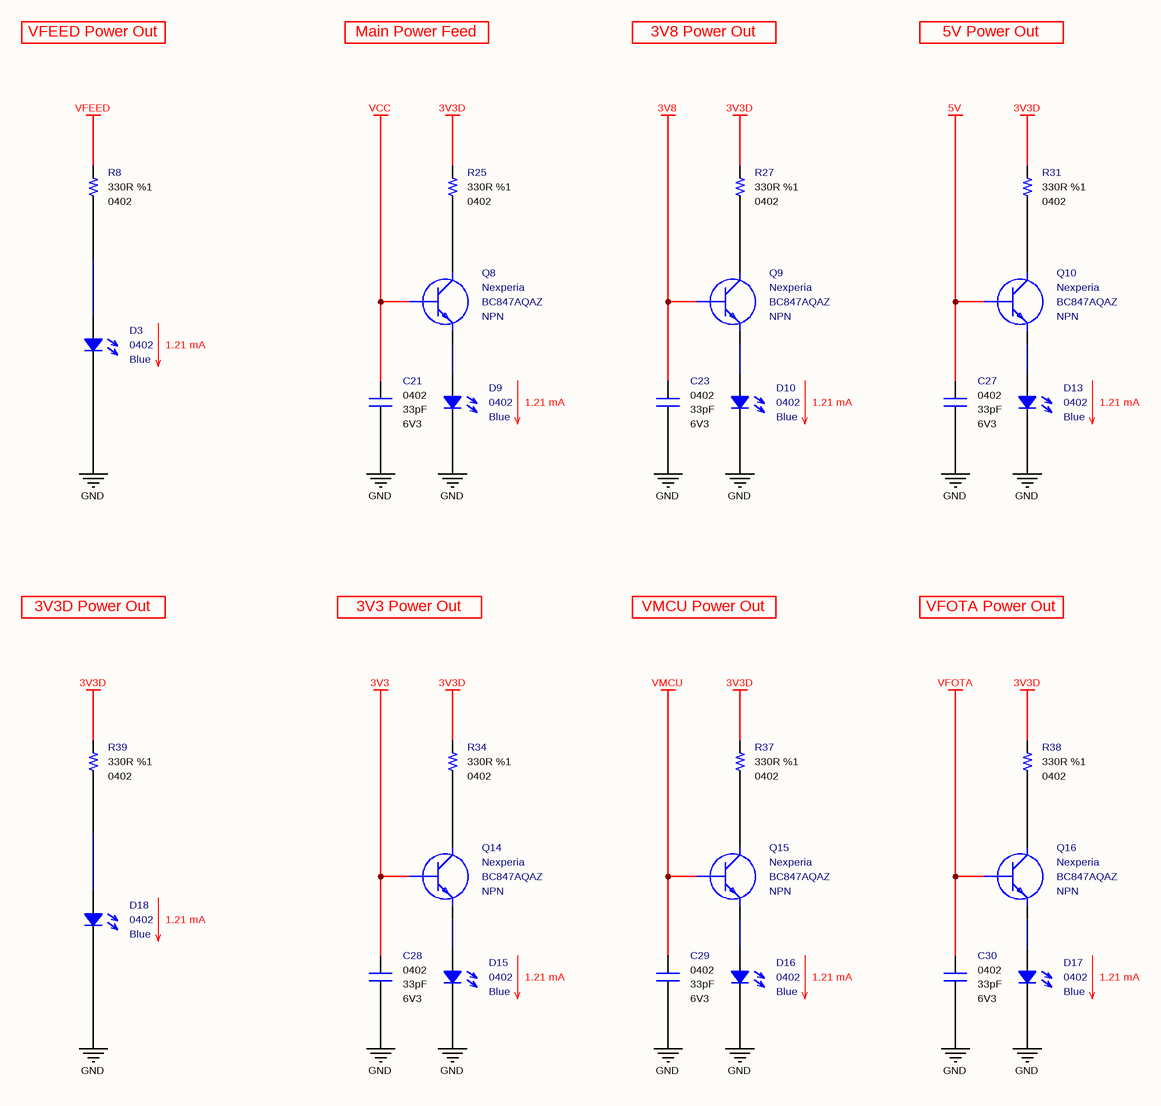
[diagram p32: Power LED Inducators.SchDoc]

### Parts
C21  value 33pF  Case: 0402  Voltage: 6V3  [CAPACITOR_0402]  (hidden comment: Multilayer Ceramic Capacitor)
C23  value 33pF  Case: 0402  Voltage: 6V3  [CAPACITOR_0402]  (hidden comment: Multilayer Ceramic Capacitor)
C27  value 33pF  Case: 0402  Voltage: 6V3  [CAPACITOR_0402]  (hidden comment: Multilayer Ceramic Capacitor)
C28  value 33pF  Case: 0402  Voltage: 6V3  [CAPACITOR_0402]  (hidden comment: Multilayer Ceramic Capacitor)
C29  value 33pF  Case: 0402  Voltage: 6V3  [CAPACITOR_0402]  (hidden comment: Multilayer Ceramic Capacitor)
C30  value 33pF  Case: 0402  Voltage: 6V3  [CAPACITOR_0402]  (hidden comment: Multilayer Ceramic Capacitor)
D3  Case: 0402  Color: Blue  [LED_0402]  (hidden comment: SMD LED (Blue))
D9  Case: 0402  Color: Blue  [LED_0402]  (hidden comment: SMD LED (Blue))
D10  Case: 0402  Color: Blue  [LED_0402]  (hidden comment: SMD LED (Blue))
D13  Case: 0402  Color: Blue  [LED_0402]  (hidden comment: SMD LED (Blue))
D15  Case: 0402  Color: Blue  [LED_0402]  (hidden comment: SMD LED (Blue))
D16  Case: 0402  Color: Blue  [LED_0402]  (hidden comment: SMD LED (Blue))
D17  Case: 0402  Color: Blue  [LED_0402]  (hidden comment: SMD LED (Blue))
D18  Case: 0402  Color: Blue  [LED_0402]  (hidden comment: SMD LED (Blue))
Q8  Manufacturer_Name: Nexperia  Manufacturer_Part_Number: BC847AQAZ  Polarity: NPN  [SOT1215]  (hidden comment: Bipolar NPN Transistors)
Q9  Manufacturer_Name: Nexperia  Manufacturer_Part_Number: BC847AQAZ  Polarity: NPN  [SOT1215]  (hidden comment: Bipolar NPN Transistors)
Q10  Manufacturer_Name: Nexperia  Manufacturer_Part_Number: BC847AQAZ  Polarity: NPN  [SOT1215]  (hidden comment: Bipolar NPN Transistors)
Q14  Manufacturer_Name: Nexperia  Manufacturer_Part_Number: BC847AQAZ  Polarity: NPN  [SOT1215]  (hidden comment: Bipolar NPN Transistors)
Q15  Manufacturer_Name: Nexperia  Manufacturer_Part_Number: BC847AQAZ  Polarity: NPN  [SOT1215]  (hidden comment: Bipolar NPN Transistors)
Q16  Manufacturer_Name: Nexperia  Manufacturer_Part_Number: BC847AQAZ  Polarity: NPN  [SOT1215]  (hidden comment: Bipolar NPN Transistors)
R8  value 330R  Tolerance: %1  Case: 0402  [RESISTOR_0402]  (hidden comment: Thick Film Resistor)
R25  value 330R  Tolerance: %1  Case: 0402  [RESISTOR_0402]  (hidden comment: Thick Film Resistor)
R27  value 330R  Tolerance: %1  Case: 0402  [RESISTOR_0402]  (hidden comment: Thick Film Resistor)
R31  value 330R  Tolerance: %1  Case: 0402  [RESISTOR_0402]  (hidden comment: Thick Film Resistor)
R34  value 330R  Tolerance: %1  Case: 0402  [RESISTOR_0402]  (hidden comment: Thick Film Resistor)
R37  value 330R  Tolerance: %1  Case: 0402  [RESISTOR_0402]  (hidden comment: Thick Film Resistor)
R38  value 330R  Tolerance: %1  Case: 0402  [RESISTOR_0402]  (hidden comment: Thick Film Resistor)
R39  value 330R  Tolerance: %1  Case: 0402  [RESISTOR_0402]  (hidden comment: Thick Film Resistor)

### Nets
3V3: C28.1 Q14.1(B)
3V3D: R25.2 R27.2 R31.2 R34.2 R37.2 R38.2 R39.2
3V8: C23.1 Q9.1(B)
5V: C27.1 Q10.1(B)
GND: C21.2 C23.2 C27.2 C28.2 C29.2 C30.2 D3.1 D9.1 D10.1 D13.1 D15.1 D16.1 D17.1 D18.1
VCC: C21.1 Q8.1(B)
VFEED: R8.2
VFOTA: C30.1 Q16.1(B)
VMCU: C29.1 Q15.1(B)
NetD3_2: D3.2 R8.1
NetD9_2: D9.2 Q8.2(E)
NetD10_2: D10.2 Q9.2(E)
NetD13_2: D13.2 Q10.2(E)
NetD15_2: D15.2 Q14.2(E)
NetD16_2: D16.2 Q15.2(E)
NetD17_2: D17.2 Q16.2(E)
NetD18_2: D18.2 R39.1
NetQ8_3: Q8.3(C) R25.1
NetQ9_3: Q9.3(C) R27.1
NetQ10_3: Q10.3(C) R31.1
NetQ14_3: Q14.3(C) R34.1
NetQ15_3: Q15.3(C) R37.1
NetQ16_3: Q16.3(C) R38.1

### Notes on the sheet
- VFEED Power Out
- Main Power Feed
- 3V8 Power Out
- 5V Power Out
- 1.21 mA
- 3V3D Power Out
- 3V3 Power Out
- VMCU Power Out
- VFOTA Power Out
- Title
- Size:
- Date:
- A3
- Number:
- Time:
- Revision:
- Sheet
- of
- File:

### Library data of the parts
C21 C23 C27-C30 = Capacitor - 33pF [0402-6V3]: as C93-C95 on sheet GSM Control Signals; Height: 0.5mm; Maximum Operating Temperature: +125; Minimum Operating Temperature: -55; ROHS: Yes; ComponentLink1Description: DataSheet; ComponentLink1URL: https://api.kemet.com/component-edge/download/datasheet/C0402C330J9RACAUTO.pdf; ComponentLink2Description: Mouser; ComponentLink2URL: https://www.mouser.com/Search/Refine.aspx?Keyword=80-C0402C330J9RAUTO; Supplier 1: Mouser; Supplier Part Number 1: 80-C0402C330J9RAUTO; Mouser Part Number: 80-C0402C330J9RAUTO
D3 D9 D10 D13 D15-D18 = Diode - LED (0402-Blue): as D53-D55 on sheet GSM Control Signals; Mouser_Part_Number: 755-SMLP13BC8TT86; ROHS: Yes; ComponentLink1Description: DataSheet; ComponentLink1URL: https://d1d2qsbl8m0m72.cloudfront.net/en/products/databook/datasheet/opto/led/chip_mono/sml-p1-e.pdf; ComponentLink2Description: Mouser; ComponentLink2URL: https://www.mouser.com.tr/ProductDetail/ROHM-Semiconductor/SMLP13BC8TT86?qs=%2Fha2pyFaduidYDgXFKL%252BNZwCVZNUI4FlyPWWbVDx1b6ABmzS%252BS2f0w%3D%3D; Supplier 1: Mouser; Supplier 2: Digi-Key; Supplier Part Number 1: 755-SMLP13BC8TT86; Supplier Part Number 2: 846-1112-1-ND
Q8-Q10 Q14-Q16 = Transistor - BC847: as Q50-Q52 on sheet GSM Control Signals; Mouser_Part_Number: 771-BC847AQAZ; ComponentLink1Description: DataSheet; ComponentLink1URL: https://www.mouser.com.tr/datasheet/2/916/BC847XQA_SER-1598405.pdf; ComponentLink2Description: Mouser; ComponentLink2URL: https://www.mouser.com.tr/ProductDetail/Nexperia/BC847AQAZ?qs=%2Fha2pyFaduhKMCPKNtQimeJpXTw9z4AqURd2YARs8DVICZNv3AT9Dw%3D%3D; Case: DFN-1010D-3; Supplier 1: Mouser; Supplier 2: Digi-Key; Supplier Part Number 1: 771-BC847AQAZ; Supplier Part Number 2: 1727-2545-1-ND
R8 R25 R27 R31 R34 R37-R39 = Resistor - 330R: as R120-R122 on sheet GSM Control Signals; Height: 0.4mm; ComponentLink1Description: DataSheet; ComponentLink1URL: https://www.mouser.com.tr/datasheet/2/427/dcrcwe3-1762152.pdf; ComponentLink2Description: Mouser; ComponentLink2URL: https://www.mouser.com.tr/ProductDetail/Vishay-Dale/CRCW0402330RFKED?qs=sGAEpiMZZMu61qfTUdNhG2DpbjADlD3GGS6SwBlLi5Q%3D; Supplier 1: Mouser; Supplier 2: Digi-Key; Supplier Part Number 2: 541-330LCT-ND; Supplier Part Number 1: 71-CRCW0402-330-E3; Mouser Part Number: 71-CRCW0402-330-E3

## Sheet 3V3 LDO Regulator.SchDoc: 3V3 LDO Regulator
size A4; ApprovedBy: Mehmet Günce Akkoyun; CheckedBy: Mehmet Günce Akkoyun; Author: Mehmet Günce Akkoyun; CompanyName: Ovoo Electronics; DrawnBy: Mehmet Günce Akkoyun; Engineer: Mehmet Günce Akkoyun; Organization: Ovoo Electronics; Address1: Necip Fazýl Mah. Ortaýrmak Sok.; Address2: Birgül Apt. No: 19/6; Address3: Meram / Konya; Address4: Turkiye; DocumentNumber: AA001; Revision: B100AA Dev Kit
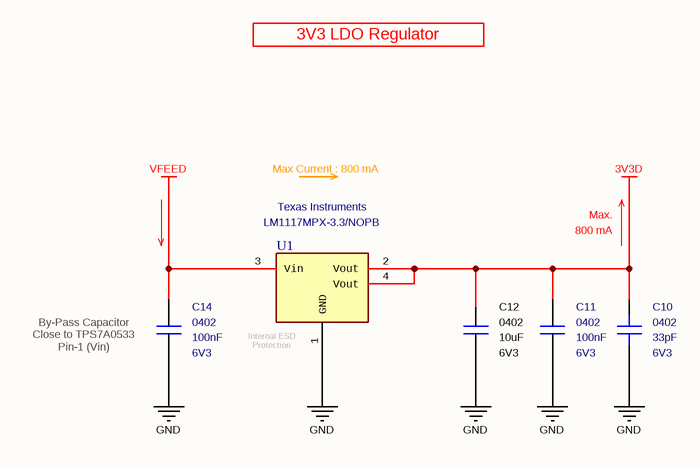
[diagram p33: 3V3 LDO Regulator.SchDoc]

### Parts
C10  value 33pF  Case: 0402  Voltage: 6V3  [CAPACITOR_0402]  (hidden comment: Multilayer Ceramic Capacitor)
C11  value 100nF  Case: 0402  Voltage: 6V3  [CAPACITOR_0402]  (hidden comment: Multilayer Ceramic Capacitor)
C12  value 10uF  Case: 0402  Voltage: 6V3  [CAPACITOR_0402]  (hidden comment: Multilayer Ceramic Capacitor)
C14  value 100nF  Case: 0402  Voltage: 6V3  [CAPACITOR_0402]  (hidden comment: Multilayer Ceramic Capacitor)
U1  Manufacturer Part Number: LM1117MPX-3.3/NOPB  Manufacturer Name: Texas Instruments  [SOT-223-4]  (hidden comment: LDO Voltage Regulator)

### Nets
3V3D: C10.1 C11.1 C12.2 U1.2(Vout) U1.4(Vout)
GND: C10.2 C11.2 C12.1 C14.2 U1.1(GND)
VFEED: C14.1 U1.3(Vin)

### Notes on the sheet
- 3V3 LDO Regulator
- Max Current : 800 mA
- 800 mA
- Max.
- (near C14) By-Pass Capacitor
  Close to TPS7A0533
  Pin-1 (Vin)
- (near U1) Internal ESD Protection
- Title
- Size:
- Date:
- A4
- Number:
- Time:
- Revision:
- Sheet
- of
- File:

### Library data of the parts
C10 = Capacitor - 33pF [0402-6V3]: as C37 on sheet ADS Sensor Sockets; Height: 0.5mm; Mouser_Part_Number: 80-C0402C330J9RAUTO; Maximum Operating Temperature: +125; Minimum Operating Temperature: -55; ROHS: Yes; ComponentLink1Description: DataSheet; ComponentLink1URL: https://api.kemet.com/component-edge/download/datasheet/C0402C330J9RACAUTO.pdf; ComponentLink2Description: Mouser; ComponentLink2URL: https://www.mouser.com/Search/Refine.aspx?Keyword=80-C0402C330J9RAUTO; Supplier 1: Mouser; Supplier Part Number 1: 80-C0402C330J9RAUTO
C11 C14 = Capacitor - 100nF [0402-6V3]: as C121 on sheet UART Communication; Height: 0.25mm; Mouser_Part_Number: 581-04026D104KAT4A; ComponentLink1Description: Mouser; ComponentLink1URL: https://www.mouser.com.tr/ProductDetail/AVX/04026D104KAT4A?qs=sGAEpiMZZMs0AnBnWHyRQPg4iYkCw7IMED%2F4kpqgf7w%3D; ComponentLink2Description: DataSheet; ComponentLink2URL: https://www.mouser.com.tr/datasheet/2/40/cx5r-776519.pdf; ROHS: Yes; Maximum Operating Temperature: +85; Minimum Operating Temperature: -55; Supplier 1: Avnet; Supplier Part Number 1: 04026D104KAT4A
C12 = Capacitor - 10uF [0402-6V3]: Capacitor - 10uF [0402] (Ceramic); Manufacturer Name: Kemet; Manufacturer Part Number: C0402C106M9PACTU; Dielectric: X5R; Tolerance: 20%; Height: 0.5mm; Mouser Part Number: 80-C0402C106M9P; Maximum Operating Temperature: +85; Minimum Operating Temperature: -55; RoHS: Yes; ComponentLink1Description: DataSheet; ComponentLink1URL: https://www.mouser.com.tr/datasheet/2/212/KEM_C1006_X5R_SMD-1103249.pdf; ComponentLink2Description: Mouser; ComponentLink2URL: https://www.mouser.com.tr/ProductDetail/KEMET/C0402C106M9PACTU?qs=sGAEpiMZZMs0AnBnWHyRQE3yiXa%2FuseC7%252BLTT67ezUCLPvFYe0E%252BJg%3D%3D; Supplier 1: Avnet; Supplier 2: Mouser; Supplier 3: Arrow; Supplier 4: Farnell; Supplier 5: Newark; Supplier 6: Farnell; Supplier 7: Digi-Key; Supplier 8: Newark; Supplier Part Number 1: C0402C106M9PACTU; Supplier Part Number 2: 80-C0402C106M9P; Supplier Part Number 3: C0402C106M9PACTU; Supplier Part Number 4: 2507061; Supplier Part Number 5: 75Y0593; Supplier Part Number 6: 2750752; Supplier Part Number 7: 399-13069-1-ND; Supplier Part Number 8: 29AC4166
U1 = IC - LM1117MPX-3.3/NOPB: LDO Voltage Regulators 800MA LDO LINEAR REG; Dropout Voltage: 1.2V; Height: 1.8mm; ComponentLink1Description: DataSheet; ComponentLink1URL: http://www.ti.com/general/docs/suppproductinfo.tsp?distId=26&gotoUrl=http%3A%2F%2Fwww.ti.com%2Flit%2Fds%2Fsymlink%2Flm1117.pdf; ComponentLink2Description: Mouser; ComponentLink2URL: https://www.mouser.com.tr/ProductDetail/Texas-Instruments/LM1117MPX-33-NOPB?qs=sGAEpiMZZMsGz1a6aV8DcCERHZHPu4lvuMKECiC7JXI%3D; Case: SOT-223-4; Maximum Operating Temperature: +125; Output Current: 800mA; Minimum Operating Temperature: -40; Mouser Part Number: 926-LM1117MPX3.3NOPB; Supplier 1: Arrow Electronics; Supplier 2: Mouser; Supplier 3: Digi-Key; Supplier 4: Digi-Key; Supplier 5: Digi-Key; Supplier 6: Farnell; Supplier 7: Farnell; Supplier 8: Farnell; Supplier 9: Newark; Supplier 10: Newark; Supplier 11: Newark; Supplier 12: RSComponents; Supplier Part Number 1: LM1117MPX-3.3/NOPB; Supplier Part Number 2: 926-LM1117MPX3.3NOPB; Supplier Part Number 3: LM1117MPX-3.3/NOPBCT-ND; Supplier Part Number 4: LM1117MPX-3.3/NOPBDKR-ND; Supplier Part Number 5: LM1117MPX-3.3/NOPBTR-ND; Supplier Part Number 6: 3122024; Supplier Part Number 7: 3116243; Supplier Part Number 8: 2148396; Supplier Part Number 9: 33AH4053; Supplier Part Number 10: 33AH4054; Supplier Part Number 11: 41K3476; Supplier Part Number 12: 2088522

## Sheet Power Test Pins.SchDoc: Power Test Pins
size A4; ApprovedBy: Mehmet Günce Akkoyun; CheckedBy: Mehmet Günce Akkoyun; Author: Mehmet Günce Akkoyun; CompanyName: Ovoo Electronics; DrawnBy: Mehmet Günce Akkoyun; Engineer: Mehmet Günce Akkoyun; Organization: Ovoo Electronics; Address1: Necip Fazýl Mah. Ortaýrmak Sok.; Address2: Birgül Apt. No: 19/6; Address3: Meram / Konya; Address4: Turkiye; DocumentNumber: AA001; Revision: B100AA Dev Kit
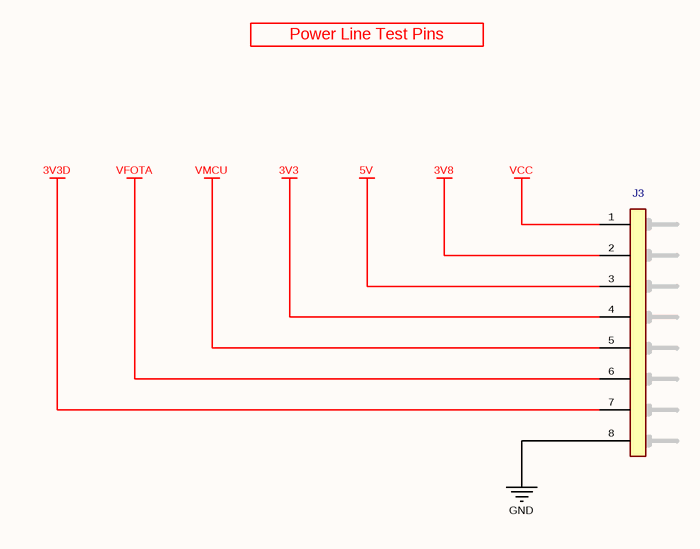
[diagram p34: Power Test Pins.SchDoc]

### Parts
J3  2.54 mm Pitch 8P Male Connector  [8P Header]  (value not drawn)

### Nets
3V3: J3.4(Pin-4)
3V3D: J3.7(Pin-7)
3V8: J3.2(Pin-2)
5V: J3.3(Pin-3)
GND: J3.8(Pin-8)
VCC: J3.1(Pin-1)
VFOTA: J3.6(Pin-6)
VMCU: J3.5(Pin-5)

### Notes on the sheet
- Power Line Test Pins
- Title
- Size:
- Date:
- A4
- Number:
- Time:
- Revision:
- Sheet
- of
- File:

### Library data of the parts
J3 = Connector - Male Header 8P (2.54): as J15 on sheet Master MCU ICSP Communication; Manufacturer Part Number: 22-28-4083; Mouser Part Number: 538-22-28-4083; ROHS: Yes; ComponentLink1Description: DataSheet; ComponentLink1URL: https://www.mouser.com.tr/datasheet/2/276/0022284063_PCB_HEADERS-228265.pdf; ComponentLink2Description: Mouser; ComponentLink2URL: https://www.mouser.com.tr/ProductDetail/Molex/22-28-4083/?qs=%2Fha2pyFaduguMWEp6M%252Bj0x6fHxUvnRGD%252BIxBoa6MO5w%3D

## Sheet External Power Feed.SchDoc: External Power Feed
size A4; ApprovedBy: Mehmet Günce Akkoyun; CheckedBy: Mehmet Günce Akkoyun; Author: Mehmet Günce Akkoyun; CompanyName: Ovoo Electronics; DrawnBy: Mehmet Günce Akkoyun; Engineer: Mehmet Günce Akkoyun; Organization: Ovoo Electronics; Address1: Necip Fazýl Mah. Ortaýrmak Sok.; Address2: Birgül Apt. No: 19/6; Address3: Meram / Konya; Address4: Turkiye; DocumentNumber: AA001; Revision: B100AA Dev Kit
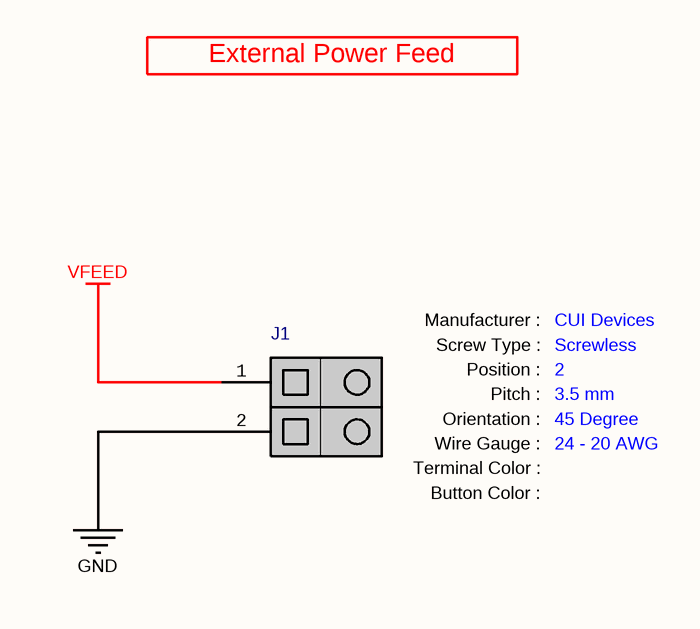
[diagram p35: External Power Feed.SchDoc]

### Parts
J1  Pitch: 3.5 mm  Manufacturer Name: CUI Devices  Position: 2  Screw Type: Screwless  Orientation: 45 Degree  Wire Gauge: 24 - 20 AWG  [TBL002A-350-02GY-2GY]  (hidden comment: Fixed Terminal Block)

### Nets
GND: J1.2(Pin-2)
VFEED: J1.1(Pin-1)

### Notes on the sheet
- External Power Feed
- Title
- Size:
- Date:
- A4
- Number:
- Time:
- Revision:
- Sheet
- of
- File:
- (in symbol Connector - Fixed Terminal Block (2 Pole 45Degre)) Manufacturer :; Screw Type :; Position :; Pitch :; Orientation :; Wire Gauge :; Terminal Color :; Button Color :

### Library data of the parts
J1 = Connector - Fixed Terminal Block (2 Pole 45Degre): Fixed Terminal Blocks Terminal block, screwless, 3.50, 45 , 2 poles, cool gray; Row: 1; Manufacturer Part Number: TBL002A-350-02GY-2GY; Mouser Part Number: 490-TBL002A3502GY2GY; ComponentLink1Description: DataSheet; ComponentLink1URL: https://www.mouser.com.tr/datasheet/2/670/tbl002a_350-1600859.pdf; ComponentLink2Description: Mouser; ComponentLink2URL: https://www.mouser.com.tr/ProductDetail/CUI-Devices/TBL002A-350-02GY-2GY/?qs=%2Fha2pyFadujrPvZITO3%2FnrmBdhdc%252BtnZMF1UJZZUjtr4sFVaDgEMMZG%252BoMytOXjZ; Supplier 1: Mouser; Supplier 2: Arrow Electronics; Supplier 3: Digi-Key; Supplier Part Number 3: 102-6367-ND; Supplier Part Number 2: TBL002A-350-02GY-2GY; Supplier Part Number 1: 490-TBL002A3502GY2GY